# EAGLE design PitchshiftDelay-dsPIC_v2.3 (EAGLE 9.1.3)

## Sheet 1 of 4
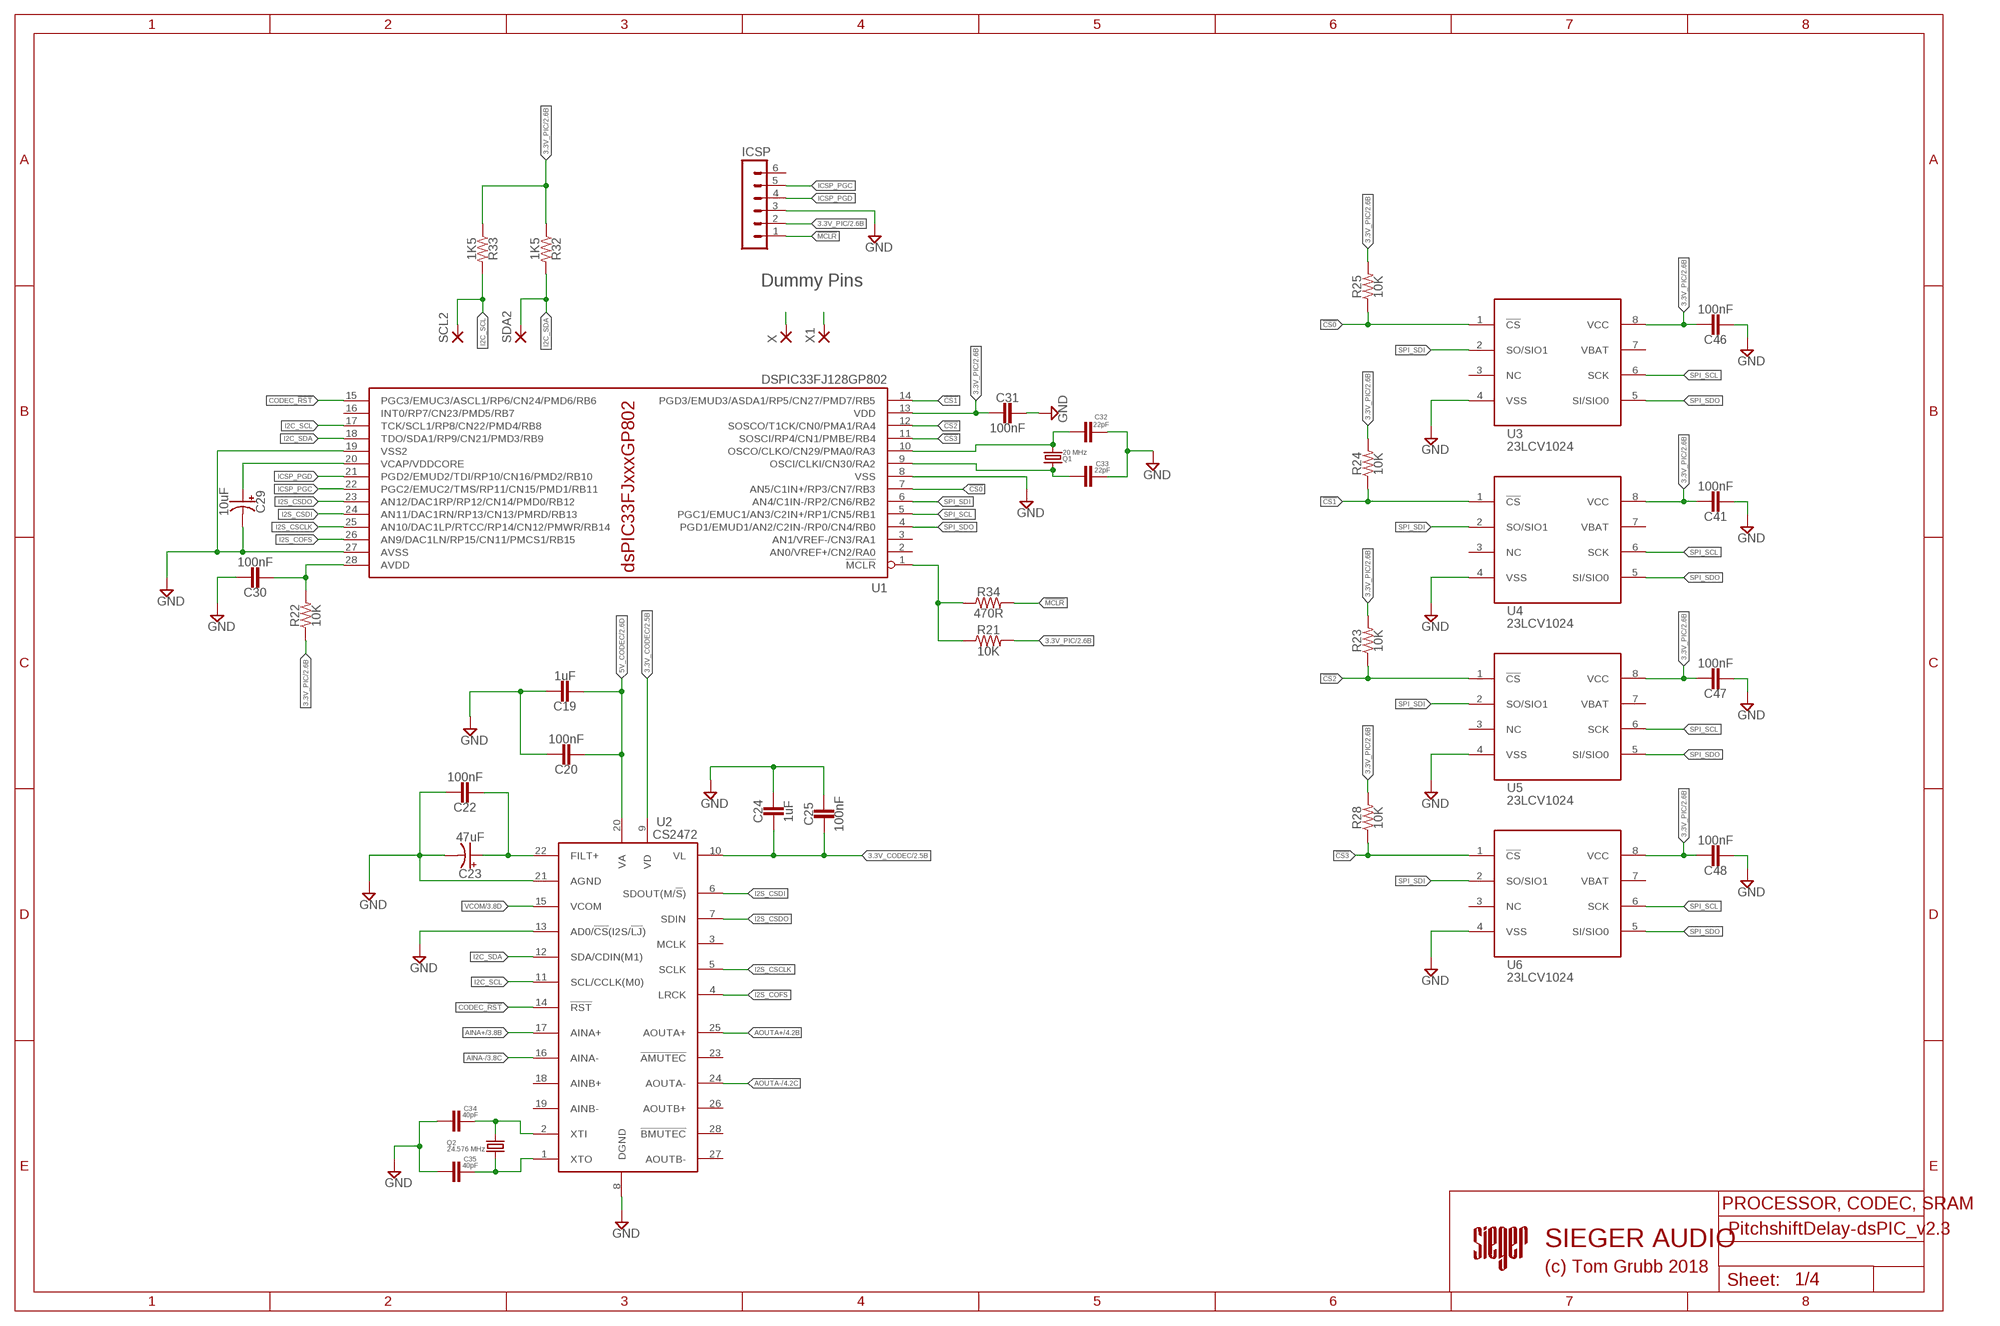
[diagram p0: schematic, sheet 1]

### Parts
C19  1uF  CER/FILM1  [050X030_025]
C20  100nF  CER/FILM1  [050X030_025]
C22  100nF  CER/FILM1  [050X030_025]
C23  47uF  0501  [050_020_1]
C24  1uF  CER/FILM1  [050X030_025]
C25  100nF  CER/FILM1  [050X030_025]
C29  10uF  0501B  [050_020_1B]
C30  100nF  CER/FILM1  [050X030_025]
C31  100nF  CER/FILM1  [050X030_025]
C32  22pF  CER/FILM  [0805]
C33  22pF  CER/FILM  [0805]
C34  40pF  CER/FILM  [0805]
C35  40pF  CER/FILM  [0805]
C41  100nF  CER/FILM1  [050X030_025]
C46  100nF  CER/FILM1  [050X030_025]
C47  100nF  CER/FILM1  [050X030_025]
C48  100nF  CER/FILM1  [050X030_025]
ICSP  MA06-1  [MA06-1]
Q1  20 MHz  CRYSTALHC49U-V  [HC49U-V]
Q2  24.576 MHz  CRYSTALHC49U-V  [HC49U-V]
R21  10K  RESISTOR0805  [RESISTOR_C0805]
R22  10K  RESISTOR0805  [RESISTOR_C0805]
R23  10K  RESISTOR0805  [RESISTOR_C0805]
R24  10K  RESISTOR0805  [RESISTOR_C0805]
R25  10K  RESISTOR0805  [RESISTOR_C0805]
R28  10K  RESISTOR0805  [RESISTOR_C0805]
R32  1K5  RESISTOR0805  [RESISTOR_C0805]
R33  1K5  RESISTOR0805  [RESISTOR_C0805]
R34  470R  RESISTOR0805  [RESISTOR_C0805]
SCL2  2,15/1,0  [2,15/1,0]
SDA2  2,15/1,0  [2,15/1,0]
U1  DSPIC33FJ128GP802  DSPIC33FJXXXGP802SMT  [SO28W]
U2  CS2472  [TSSOP28L]
U3  23LCV1024  [SOIC8]
U4  23LCV1024  [SOIC8]
U5  23LCV1024  [SOIC8]
U6  23LCV1024  [SOIC8]
X  2,15/1,0  [2,15/1,0]
X1  2,15/1,0  [2,15/1,0]

### Nets
3.3V_CODEC: C24.2 C25.2 U2.9(VD) U2.10(VL) ; also sheet 2
3.3V_PIC: C31.2 C41.1 C46.1 C47.1 C48.1 ICSP.2 R21.2 R22.1 R23.2 R24.2 R25.2 R28.2 R32.1 R33.1 U1.13(VDD) U3.8(VCC) U4.8(VCC) U5.8(VCC) U6.8(VCC) ; also sheet 2,4
5V_CODEC: C19.2 C20.2 U2.20(VA) ; also sheet 2
!CS0: R25.1 U1.7(AN5/C1IN+/RP3/CN7/RB3) U3.1(!CS)
!CS1: R24.1 U1.14(PGD3/EMUD3/ASDA1/RP5/CN27/PMD7/RB5) U4.1(!CS)
!CS2: R23.1 U1.12(SOSCO/T1CK/CN0/PMA1/RA4) U5.1(!CS)
!CS3: R28.1 U1.11(SOSCI/RP4/CN1/PMBE/RB4) U6.1(!CS)
!MCLR: ICSP.1 R34.2
AINA+: U2.17(AINA+) ; also sheet 3
AINA-: U2.16(AINA-) ; also sheet 3
AOUTA+: U2.25(AOUTA+) ; also sheet 4
AOUTA-: U2.24(AOUTA-) ; also sheet 4
CODEC_!RST: U1.15(PGC3/EMUC3/ASCL1/RP6/CN24/PMD6/RB6) U2.14(!RST)
FILT+: C22.2 C23.+ U2.22(FILT+)
GND: C19.1 C20.1 C22.1 C23.- C24.1 C25.1 C29.- C30.1 C31.1 C32.1 C33.1 C34.2 C35.2 C41.2 C46.2 C47.2 C48.2 ICSP.3 U1.8(VSS) U1.19(VSS2) U1.27(AVSS) U2.8(DGND) U2.13(AD0/!CS!(I2S/!LJ!)) U2.21(AGND) U3.4(VSS) U4.4(VSS) U5.4(VSS) U6.4(VSS) ; also sheet 2,3,4
I2C_SCL: R33.2 SCL2.1(P) U1.17(TCK/SCL1/RP8/CN22/PMD4/RB8) U2.11(SCL/CCLK(M0)) X.1(P)
I2C_SDA: R32.2 SDA2.1(P) U1.18(TDO/SDA1/RP9/CN21/PMD3/RB9) U2.12(SDA/CDIN(M1))
I2S_COFS: U1.26(AN9/DAC1LN/RP15/CN11/PMCS1/RB15) U2.4(LRCK)
I2S_CSCLK: U1.25(AN10/DAC1LP/RTCC/RP14/CN12/PMWR/RB14) U2.5(SCLK)
I2S_CSDI: U1.24(AN11/DAC1RN/RP13/CN13/PMRD/RB13) U2.6(SDOUT(M/!S!))
I2S_CSDO: U1.23(AN12/DAC1RP/RP12/CN14/PMD0/RB12) U2.7(SDIN)
ICSP_PGC: ICSP.5 U1.22(PGC2/EMUC2/TMS/RP11/CN15/PMD1/RB11)
ICSP_PGD: ICSP.4 U1.21(PGD2/EMUD2/TDI/RP10/CN16/PMD2/RB10)
N$8: C30.2 R22.2 U1.28(AVDD)
N$24: X1.1(P)
N$33: C29.+ U1.20(VCAP/VDDCORE)
N$34: C33.2 Q1.1 U1.9(OSCI/CLKI/CN30/RA2)
N$35: C32.2 Q1.2 U1.10(OSCO/CLKO/CN29/PMA0/RA3)
N$43: R21.1 R34.1 U1.1(!MCLR)
N$45: C34.1 Q2.2 U2.2(XTI)
N$48: C35.1 Q2.1 U2.1(XTO)
SPI_SCL: U1.5(PGC1/EMUC1/AN3/C2IN+/RP1/CN5/RB1) U3.6(SCK) U4.6(SCK) U5.6(SCK) U6.6(SCK)
SPI_SDI: U1.6(AN4/C1IN-/RP2/CN6/RB2) U3.2(SO/SIO1) U4.2(SO/SIO1) U5.2(SO/SIO1) U6.2(SO/SIO1)
SPI_SDO: U1.4(PGD1/EMUD1/AN2/C2IN-/RP0/CN4/RB0) U3.5(SI/SIO0) U4.5(SI/SIO0) U5.5(SI/SIO0) U6.5(SI/SIO0)
VCOM: U2.15(VCOM) ; also sheet 3
Unconnected: ICSP.6 U1.2(AN0/VREF+/CN2/RA0) U1.3(AN1/VREF-/CN3/RA1) U1.16(INT0/RP7/CN23/PMD5/RB7) U2.3(MCLK) U2.18(AINB+) U2.19(AINB-) U2.23(!AMUTEC) U2.26(AOUTB+) U2.27(AOUTB-) U2.28(!BMUTEC) U3.3(NC) U3.7(VBAT) U4.3(NC) U4.7(VBAT) U5.3(NC) U5.7(VBAT) U6.3(NC) U6.7(VBAT)

### Notes on the sheet
- Dummy Pins
- PROCESSOR, CODEC, SRAM
- SIEGER AUDIO
- (c) Tom Grubb 2018

## Sheet 2 of 4
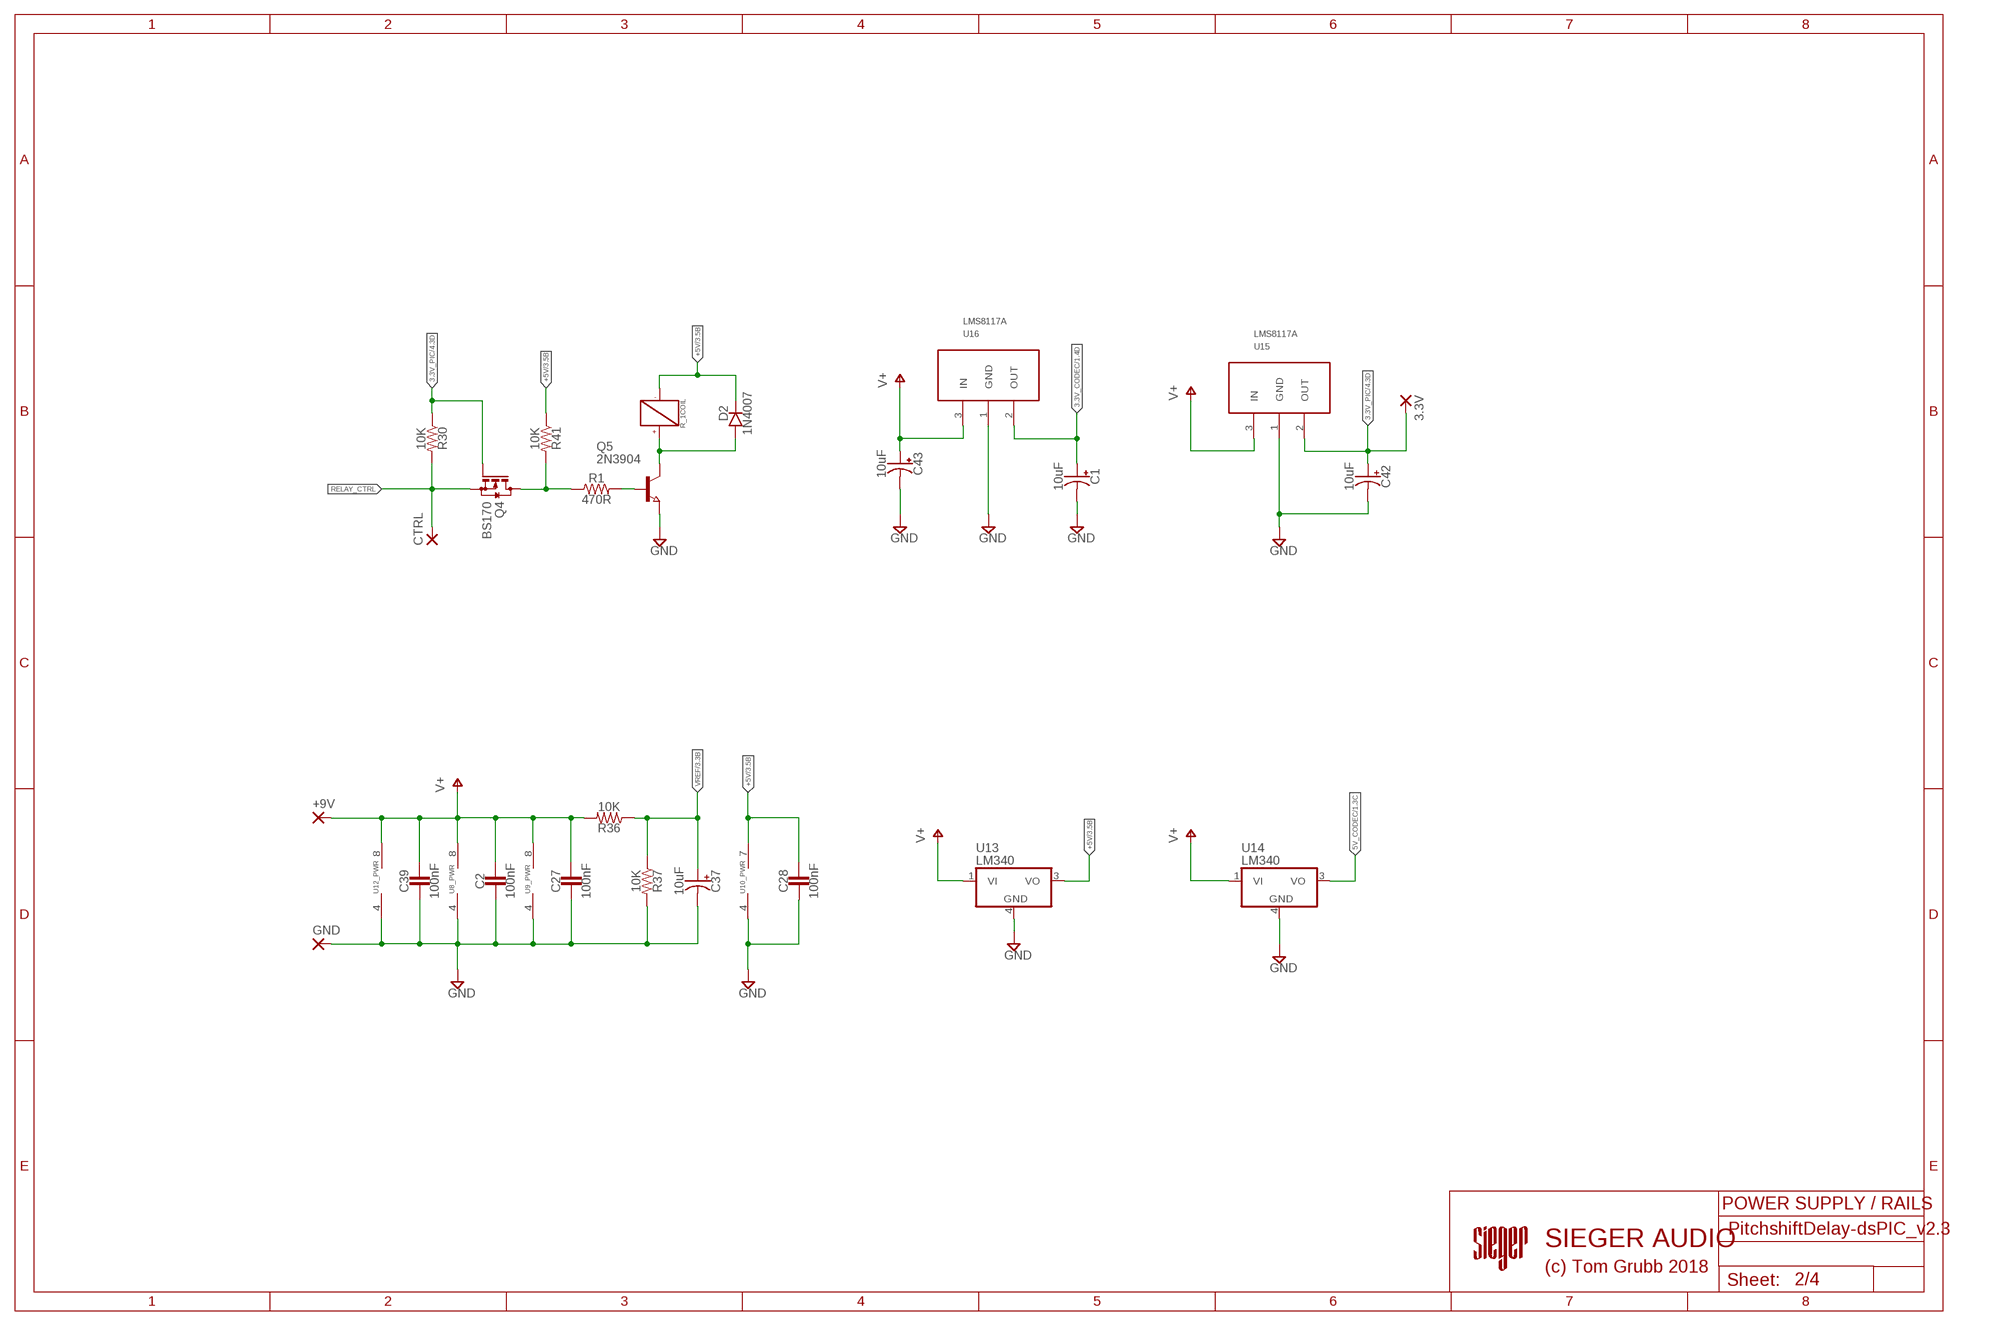
[diagram p1: schematic, sheet 2]

### Parts
3.3V  2,15/1,0  [2,15/1,0]
+9V  2,15/1,0  [2,15/1,0]
C1  10uF  0501  [050_020_1]
C2  100nF  CER/FILM1  [050X030_025]
C27  100nF  CER/FILM1  [050X030_025]
C28  100nF  CER/FILM1  [050X030_025]
C37  10uF  0501  [050_020_1]
C39  100nF  CER/FILM1  [050X030_025]
C42  10uF  0501  [050_020_1]
C43  10uF  0501  [050_020_1]
CTRL  2,15/1,0  [2,15/1,0]
D2  1N4007  DO35.3  [DO35-3]
GND  2,15/1,0  [2,15/1,0]
Q4  BS170  BSS123  [SOT23]
Q5  2N3904  NPN-TRANSISTOR_SOT23  [SOT23]
R1  470R  RESISTOR0805  [RESISTOR_C0805]
R30  10K  RESISTOR0805  [RESISTOR_C0805]
R36  10K  RESISTOR0805  [RESISTOR_C0805]
R37  10K  RESISTOR0805  [RESISTOR_C0805]
R41  10K  RESISTOR0805  [RESISTOR_C0805]
R_1  AL5WNK_2  [10PIN]
U8  LF353  DUALSMD  [SO08]
U9  LF353  DUALSMD  [SO08]
U10  OP1177  [MSOP8]
U12  LF353  DUALSMD  [SO08]
U13  LM340  LM340MP-05  [SOT223]
U14  LM340  LM340MP-05  [SOT223]
U15  LMS8117A  [SOT223]
U16  LMS8117A  [SOT223]

### Nets
3.3V_CODEC: C1.+ U16.2(OUT) ; also sheet 1
3.3V_PIC: 3.3V.1(P) C42.+ Q4.1(G) R30.1 U15.2(OUT) ; also sheet 1,4
5V_CODEC: U14.3(VO) ; also sheet 1
+5V: C28.1 D2.C R41.1 R_1.P$10(COIL:-) U10.7(_PWR:V+) U13.3(VO) ; also sheet 3
GND: C1.- C2.2 C27.2 C28.2 C37.- C39.2 C42.- C43.- GND.1(P) Q5.2(E) R37.2 U8.4(_PWR:V-) U9.4(_PWR:V-) U10.4(_PWR:V-) U12.4(_PWR:V-) U13.4(GND) U14.4(GND) U15.1(GND) U16.1(GND) ; also sheet 1,3,4
N$6: Q5.1(B) R1.2
N$22: D2.A Q5.3(C) R_1.P$1(COIL:+)
N$54: Q4.3(D) R1.1 R41.2
RELAY_CTRL: CTRL.1(P) Q4.2(S) R30.2
V+: +9V.1(P) C2.1 C27.1 C39.1 C43.+ R36.2 U8.8(_PWR:V+) U9.8(_PWR:V+) U12.8(_PWR:V+) U13.1(VI) U14.1(VI) U15.3(IN) U16.3(IN)
VREF: C37.+ R36.1 R37.1 ; also sheet 3,4

### Notes on the sheet
- POWER SUPPLY / RAILS
- SIEGER AUDIO
- (c) Tom Grubb 2018

## Sheet 3 of 4
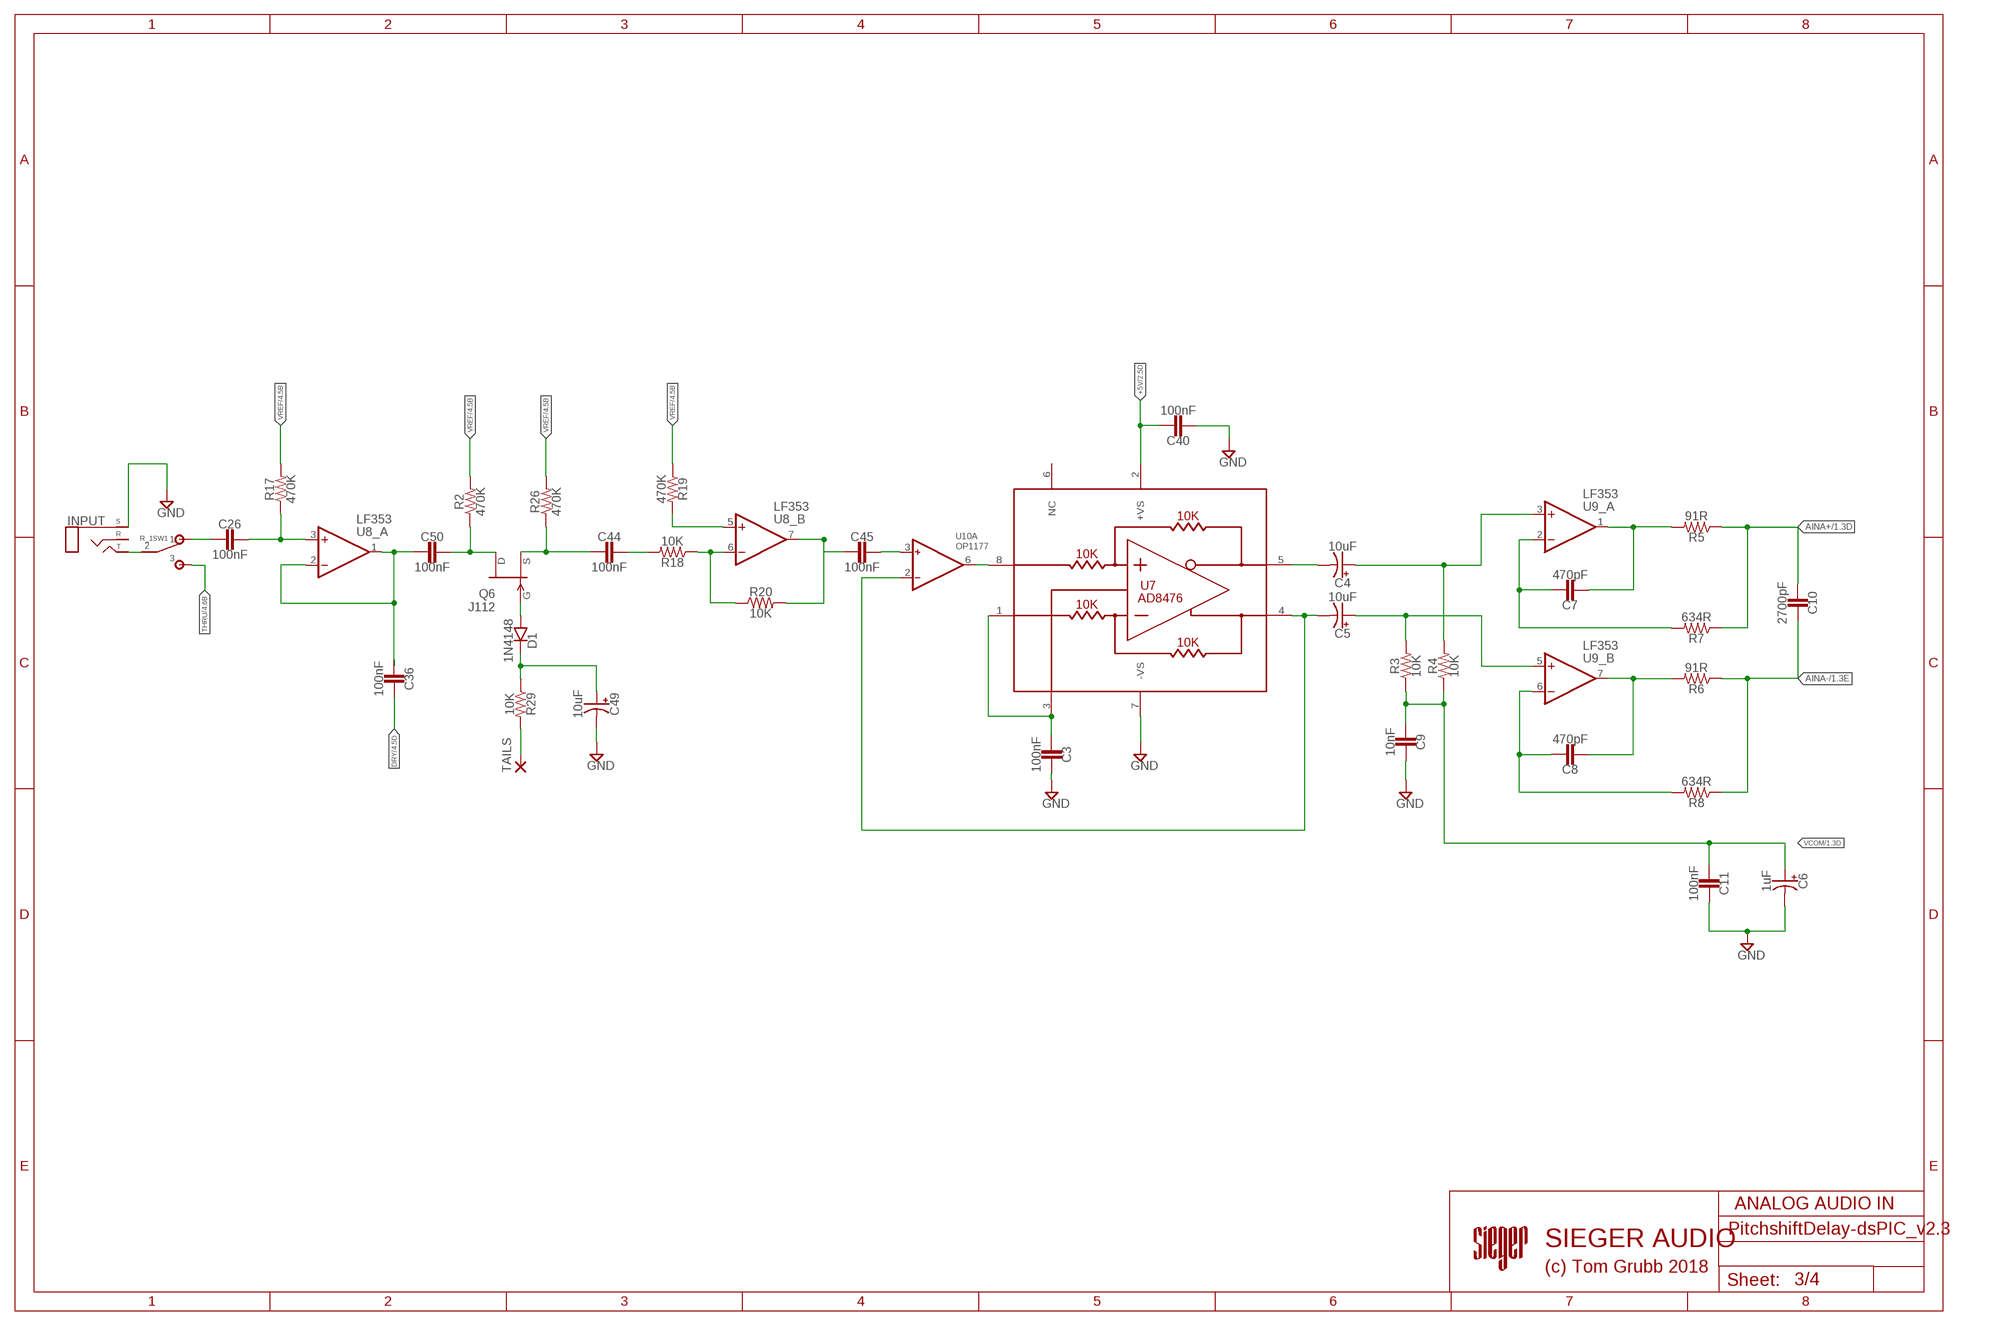
[diagram p2: schematic, sheet 3]

### Parts
C3  100nF  CER/FILM1  [050X030_025]
C4  10uF  0501  [050_020_1]
C5  10uF  0501  [050_020_1]
C6  1uF  0501  [050_020_1]
C7  470pF  CER/FILMBOX.1  [BOX_SMALL]
C8  470pF  CER/FILMBOX.1  [BOX_SMALL]
C9  10nF  CER/FILM1  [050X030_025]
C10  2700pF  CER/FILMBOX.1  [BOX_SMALL]
C11  100nF  CER/FILM1  [050X030_025]
C26  100nF  CER/FILMBOX.1  [BOX_SMALL]
C36  100nF  CER/FILMBOX.1  [BOX_SMALL]
C40  100nF  CER/FILM1  [050X030_025]
C44  100nF  CER/FILMBOX.1  [BOX_SMALL]
C45  100nF  CER/FILMBOX.1  [BOX_SMALL]
C49  10uF  0501  [050_020_1]
C50  100nF  CER/FILMBOX.1  [BOX_SMALL]
D1  1N4148  DO35.3  [DO35-3]
INPUT  STEREO  [STEREO_PCB]
Q6  J112  SST201  [SOT23]
R2  470K  RESISTOR0805  [RESISTOR_C0805]
R3  10K  RESISTOR0805  [RESISTOR_C0805]
R4  10K  RESISTOR0805  [RESISTOR_C0805]
R5  91R  RESISTOR0805  [RESISTOR_C0805]
R6  91R  RESISTOR0805  [RESISTOR_C0805]
R7  634R  RESISTOR0805  [RESISTOR_C0805]
R8  634R  RESISTOR0805  [RESISTOR_C0805]
R17  470K  RESISTOR0805  [RESISTOR_C0805]
R18  10K  RESISTOR0805  [RESISTOR_C0805]
R19  470K  RESISTOR0805  [RESISTOR_C0805]
R20  10K  RESISTOR0805  [RESISTOR_C0805]
R26  470K  RESISTOR0805  [RESISTOR_C0805]
R29  10K  RESISTOR0805  [RESISTOR_C0805]
TAILS  2,15/1,0  [2,15/1,0]
U7  AD8476  [MSOP8]

### Nets
+5V: C40.1 U7.2(+VS) ; also sheet 2
AINA+: C10.2 R5.1 R7.1 ; also sheet 1
AINA-: C10.1 R6.1 R8.1 ; also sheet 1
DRY: C36.1 ; also sheet 4
GND: C3.1 C6.- C9.1 C11.1 C40.2 C49.- INPUT.P$1(S) U7.7(-VS) ; also sheet 1,2,4
N$1: C45.1 U10.3(A:+IN)
N$3: C3.2 U7.1(IN-) U7.3(VCOM)
N$4: U7.8(IN+) U10.6(A:OUT)
N$5: C5.- U7.4(+OUT) U10.2(A:-IN)
N$7: C36.2 C50.2 U8.1(_A:OUT) U8.2(_A:-IN)
N$10: C26.1 R17.1 U8.3(_A:+IN)
N$11: C4.- U7.5(-OUT)
N$12: C5.+ R3.2 U9.5(_B:+IN)
N$13: C4.+ R4.2 U9.3(_A:+IN)
N$15: C8.1 R8.2 U9.6(_B:-IN)
N$16: C8.2 R6.2 U9.7(_B:OUT)
N$17: C7.1 R7.2 U9.2(_A:-IN)
N$18: C7.2 R5.2 U9.1(_A:OUT)
N$28: C26.2 R_1.P$2
N$29: R18.1 R20.1 U8.6(_B:-IN)
N$30: R19.2 U8.5(_B:+IN)
N$31: C50.1 Q6.1(D) R2.1
N$32: C45.2 R20.2 U8.7(_B:OUT)
N$37: C44.1 R18.2
N$39: INPUT.P$3(T) R_1.P$3
N$40: C44.2 Q6.2(S) R26.1
N$41: C49.+ D1.C R29.1
N$46: D1.A Q6.3(G)
N$51: R29.2 TAILS.1(P)
THRU: R_1.P$4 ; also sheet 4
VCOM: C6.+ C9.2 C11.2 R3.1 R4.1 ; also sheet 1
VREF: R2.2 R17.2 R19.1 R26.2 ; also sheet 2,4
Unconnected: INPUT.P$2(R) U7.6(NC)

### Notes on the sheet
- ANALOG AUDIO IN
- SIEGER AUDIO
- (c) Tom Grubb 2018

## Sheet 4 of 4
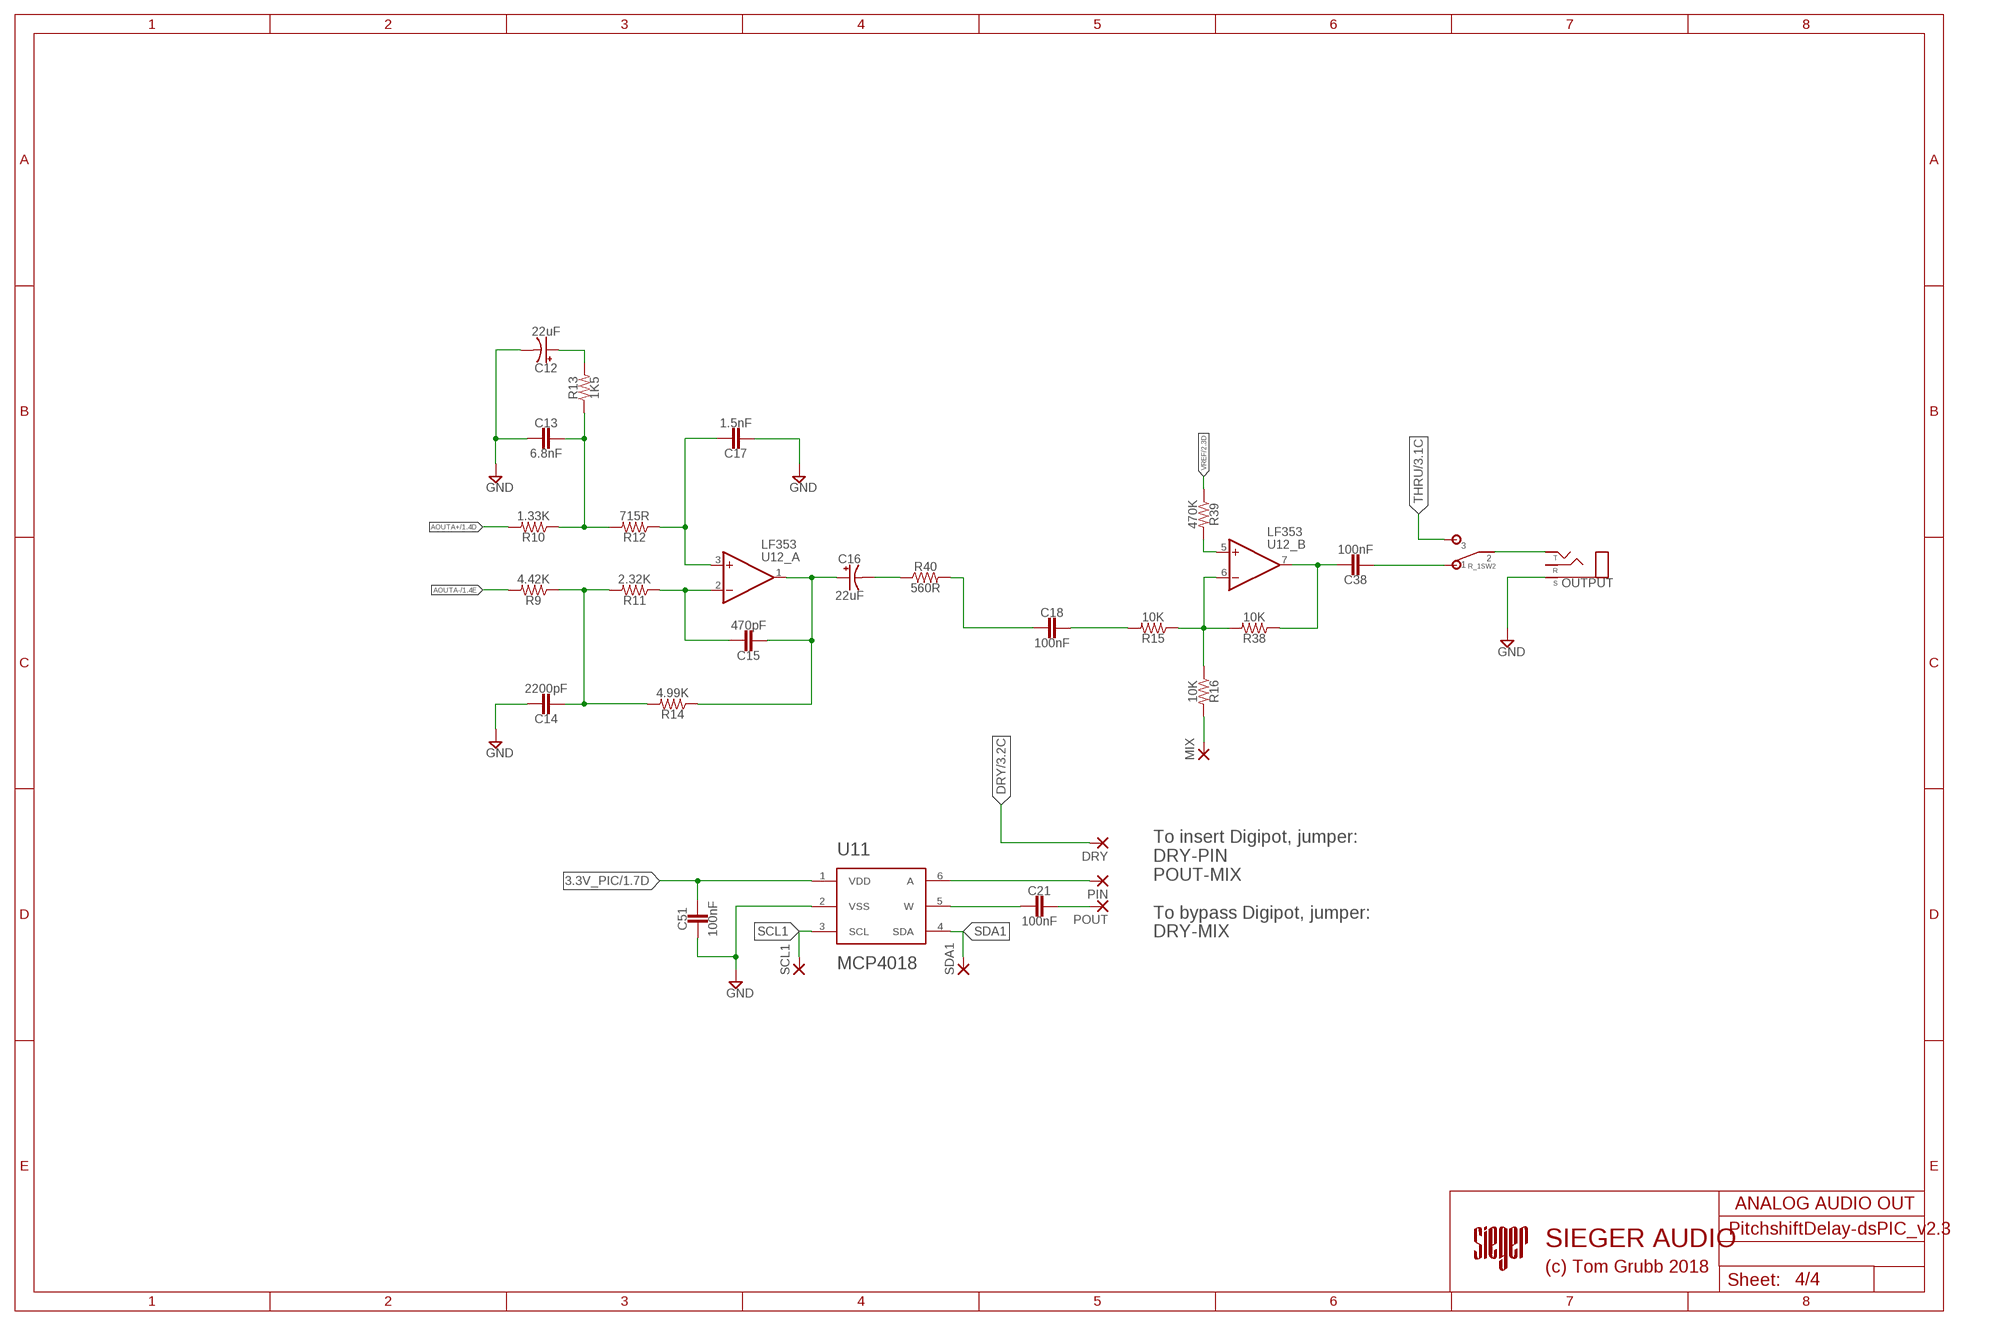
[diagram p3: schematic, sheet 4]

### Parts
C12  22uF  0501  [050_020_1]
C13  6.8nF  CER/FILMBOX.1  [BOX_SMALL]
C14  2200pF  CER/FILMBOX.1  [BOX_SMALL]
C15  470pF  CER/FILMBOX.1  [BOX_SMALL]
C16  22uF  0501  [050_020_1]
C17  1.5nF  CER/FILMBOX.1  [BOX_SMALL]
C18  100nF  CER/FILMBOX.1  [BOX_SMALL]
C21  100nF  CER/FILMBOX.1  [BOX_SMALL]
C38  100nF  CER/FILMBOX.1  [BOX_SMALL]
C51  100nF  CER/FILM1  [050X030_025]
DRY  2,15/1,0  [2,15/1,0]
MIX  2,15/1,0  [2,15/1,0]
OUTPUT  STEREO  [STEREO_PCB]
PIN  2,15/1,0  [2,15/1,0]
POUT  2,15/1,0  [2,15/1,0]
R9  4.42K  RESISTOR0805  [RESISTOR_C0805]
R10  1.33K  RESISTOR0805  [RESISTOR_C0805]
R11  2.32K  RESISTOR0805  [RESISTOR_C0805]
R12  715R  RESISTOR0805  [RESISTOR_C0805]
R13  1K5  RESISTOR0805  [RESISTOR_C0805]
R14  4.99K  RESISTOR0805  [RESISTOR_C0805]
R15  10K  RESISTOR0805  [RESISTOR_C0805]
R16  10K  RESISTOR0805  [RESISTOR_C0805]
R38  10K  RESISTOR0805  [RESISTOR_C0805]
R39  470K  RESISTOR0805  [RESISTOR_C0805]
R40  560R  RESISTOR0805  [RESISTOR_C0805]
SCL1  2,15/1,0  [2,15/1,0]
SDA1  2,15/1,0  [2,15/1,0]
U11  MCP4018  MCP401X  [SC70-6]

### Nets
3.3V_PIC: C51.1 U11.1(VDD) ; also sheet 1,2
AMUTE: C18.2 R40.2
AOUTA+: R10.2 ; also sheet 1
AOUTA-: R9.2 ; also sheet 1
DRY: DRY.1(P) ; also sheet 3
GND: C12.- C13.2 C14.1 C17.2 C51.2 OUTPUT.P$1(S) U11.2(VSS) ; also sheet 1,2,3
N$2: C21.2 U11.5(W)
N$9: C16.- R40.1
N$14: C13.1 R10.1 R12.2 R13.1
N$19: C14.2 R9.1 R11.2 R14.2
N$20: C15.1 R11.1 U12.2(_A:-IN)
N$21: C17.1 R12.1 U12.3(_A:+IN)
N$23: C15.2 C16.+ R14.1 U12.1(_A:OUT)
N$25: MIX.1(P) R16.2
N$26: C18.1 R15.2
N$27: C12.+ R13.2
N$36: OUTPUT.P$3(T) R_1.P$8
N$38: C38.2 R_1.P$9
N$42: PIN.1(P) U11.6(A)
N$44: R15.1 R16.1 R38.2 U12.6(_B:-IN)
N$47: C38.1 R38.1 U12.7(_B:OUT)
N$49: R39.2 U12.5(_B:+IN)
N$50: C21.1 POUT.1(P)
SCL1: SCL1.1(P) U11.3(SCL)
SDA1: SDA1.1(P) U11.4(SDA)
THRU: R_1.P$7 ; also sheet 3
VREF: R39.1 ; also sheet 2,3
Unconnected: OUTPUT.P$2(R)

### Notes on the sheet
- To insert Digipot, jumper:
  DRY-PIN
  POUT-MIX
  
  To bypass Digipot, jumper:
  DRY-MIX
- ANALOG AUDIO OUT
- SIEGER AUDIO
- (c) Tom Grubb 2018

## Library data of the parts
3.3V +9V CTRL DRY GND MIX PIN POUT SCL1 SCL2 SDA1 SDA2 TAILS X X1 = wirepad:2,15/1,0: THROUGH-HOLE PAD
C1 C4-C6 C12 C16 C23 C29 C37 C42 C43 C49 = MBP_capacitors-elec:050: 0.22 - 100uF Xicon values at Mouser.com: 10V: 10 - 100uF; 16V: 2.2 - 47uF; 25V: 0.47 - 47uF; 50V: 0.22 - 22uF
C2 C3 C7-C11 C13-C15 C17-C22 C24-C28 C30-C36 C38-C41 C44-C48 C50 C51 = MBP_capacitors-film:CER/FILM: 47 - 120pF Xicon Ceramic Disc 2.5mm lead spacing
D1 D2 = MBP_diodes:DO35: DO-35 Package Diodes: 1N914
ICSP = con-lstb:MA06-1: PIN HEADER; OC_FARNELL: unknown; OC_NEWARK: unknown
INPUT OUTPUT = MBP_jacks:STEREO
Q1 Q2 = crystal:CRYSTAL: CRYSTAL; OC_FARNELL: 1666969; OC_NEWARK: unknown
Q4 = transistor-small-signal:BSS123: N-CHANNEL MOS FET
Q5 = semicon-smd-ipc:NPN-TRANSISTOR_: NPN TRANSISTOR
Q6 = transistor-fet:?20*: TEMIC / Siliconix N-Channel JFET Source: JFET-J201_Siliconix_data.pdf
R1-R26 R28-R30 R32-R34 R36-R41 = MBP_SMD:RESISTOR
R_1 = MBP_Relay:AL5WNK_2
U1 = microchip-dspic33:DSPIC33FJXXXGP802: High-Performance, 16-bit Digital Signal Controllers - dsPIC33FJ64GP802 & dsPIC33FJ128GP802 Source: http://ww1.microchip.com/downloads/en/DeviceDoc/70292B.pdf Operating Range: . Up to 40 MIPS operation (at 3.0-3.6V): - Industrial temperature range (-40°C to +85°C) - Extended temperature range (-40°C to +125°C) High-Performance DSC CPU: . Modified Harvard architecture . C compiler optimized instruction set . 16-bit wide data path . 24-bit wide instructions . Linear program memory addressing up to 4M instruction words . Linear data memory addressing up to 64 Kbytes . 83 base instructions: mostly 1 word/1 cycle . Two 40-bit accumulators with rounding and saturation options . Flexible and powerful addressing modes: - Indirect - Modulo - Bit-Reversed . Software stack . 16 x 16 fractional/integer multiply operations . 32/16 and 16/16 divide operations . Single-cycle multiply and accumulate: - Accumulator write back for DSP operations - Dual data fetch . Up to ±16-bit shifts for up to 40-bit data On-Chip Flash and SRAM: . Flash program memory . Data SRAM . Boot, Secure, and General Security for program Flash Direct Memory Access (DMA): . 8-channel hardware DMA . Up to 2 Kbytes dual ported DMA buffer area (DMA RAM) to store data transferred via DMA: - Allows data transfer between RAM and a peripheral while CPU is executing code (no cycle stealing) . Most peripherals support DMA Timers/Capture/Compare/PWM: . Timer/Counters, up to five 16-bit timers: - Can pair up to make two 32-bit timers - One timer runs as a Real-Time Clock with an external 32.768 kHz oscillator - Programmable prescaler . Input Capture (up to four channels): - Capture on up, down or both edges - 16-bit capture input functions - 4-deep FIFO on each capture . Output Compare (up to four channels): - Single or Dual 16-bit Compare mode - 16-bit Glitchless PWM mode . Hardware Real-Time Clock/Calendar (RTCC): - Provides clock, calendar, and alarm functions Interrupt Controller: . 5-cycle latency . 118 interrupt vectors . Up to 49 available interrupt sources . Up to three external interrupts . Seven programmable priority levels . Five processor exceptions Digital I/O: . Peripheral pin Select functionality . Up to 35 programmable digital I/O pins . Wake-up/Interrupt-on-Change for up to 21 pins . Output pins can drive from 3.0V to 3.6V . Up to 5V output with open drain configuration . All digital input pins are 5V tolerant . 4 mA sink on all I/O pins System Management: . Flexible clock options: - External, crystal, resonator, internal RC - Fully integrated Phase-Locked Loop (PLL) - Extremely low jitter PLL . Power-up Timer . Oscillator Start-up Timer/Stabilizer . Watchdog Timer with its own RC oscillator . Fail-Safe Clock Monitor . Reset by multiple sources Power Management: . On-chip 2.5V voltage regulator . Switch between clock sources in real time . Idle, Sleep, and Doze modes with fast wake-up Analog-to-Digital Converters (ADCs): . 10-bit, 1.1 Msps or 12-bit, 500 Ksps conversion: - Two and four simultaneous samples (10-bit ADC) - Up to 13 input channels with auto-scanning - Conversion start can be manual or synchronized with one of four trigger sources - Conversion possible in Sleep mode - ±2 LSb max integral nonlinearity - ±1 LSb max differential nonlinearity Audio Digital-to-Analog Converter (DAC): . 16-bit Dual Channel DAC module . 100 Ksps maximum sampling rate . Second-Order Digital Delta-Sigma Modulator Data Converter Interface (DCI) module: . Codec interface . Supports I2S and AC.97 protocols . Up to 16-bit data words, up to 16 words per frame . 4-word deep TX and RX buffers Comparator Module: . Two analog comparators with programmable input/output configuration CMOS Flash Technology: . Low-power, high-speed Flash technology . Fully static design . 3.3V (±10%) operating voltage . Industrial and Extended temperature . Low power consumption Communication Modules: . 4-wire SPI (up to two modules): - Framing supports I/O interface to simple codecs - Supports 8-bit and 16-bit data - Supports all serial clock formats and sampling modes . I2C?: - Full Multi-Master Slave mode support - 7-bit and 10-bit addressing - Bus collision detection and arbitration - Integrated signal conditioning - Slave address masking . UART (up to two modules): - Interrupt on address bit detect - Interrupt on UART error - Wake-up on Start bit from Sleep mode - 4-character TX and RX FIFO buffers - LIN bus support - IrDA® encoding and decoding in hardware - High-Speed Baud mode - Hardware Flow Control with CTS and RTS . Enhanced CAN (ECAN. module) 2.0B active: - Up to eight transmit and up to 32 receive buffers - 16 receive filters and three masks - Loopback, Listen Only and Listen All - Messages modes for diagnostics and bus monitoring - Wake-up on CAN message - Automatic processing of Remote Transmission Requests - FIFO mode using DMA - DeviceNet. addressing support . Parallel Master Slave Port (PMP/EPSP): - Supports 8-bit or 16-bit data - Supports 16 address lines . Programmable Cyclic Redundancy Check (CRC): - Programmable bit length for the CRC generator polynomial (up to 16-bit length) - 8-deep, 16-bit or 16-deep, 8-bit FIFO for data input
U2 = CS4272:CS2472
U3-U6 = MicrochipSRAM:23LCV1024
U7 = ad8476:AD8476
U8 U9 U12 = MBP_integrated circuits:DUAL: OP AMP
U10 = AD_MSOP:OP1177
U11 = MicrochipDigiPot:MCP401X
U13 U14 = linear:LM340?-*: Positive VOLTAGE REGULATOR Source: http://cache.national.com/ds/LM/LM340.pdf
U15 U16 = LDO_Regulators:LMS8117A

## Board
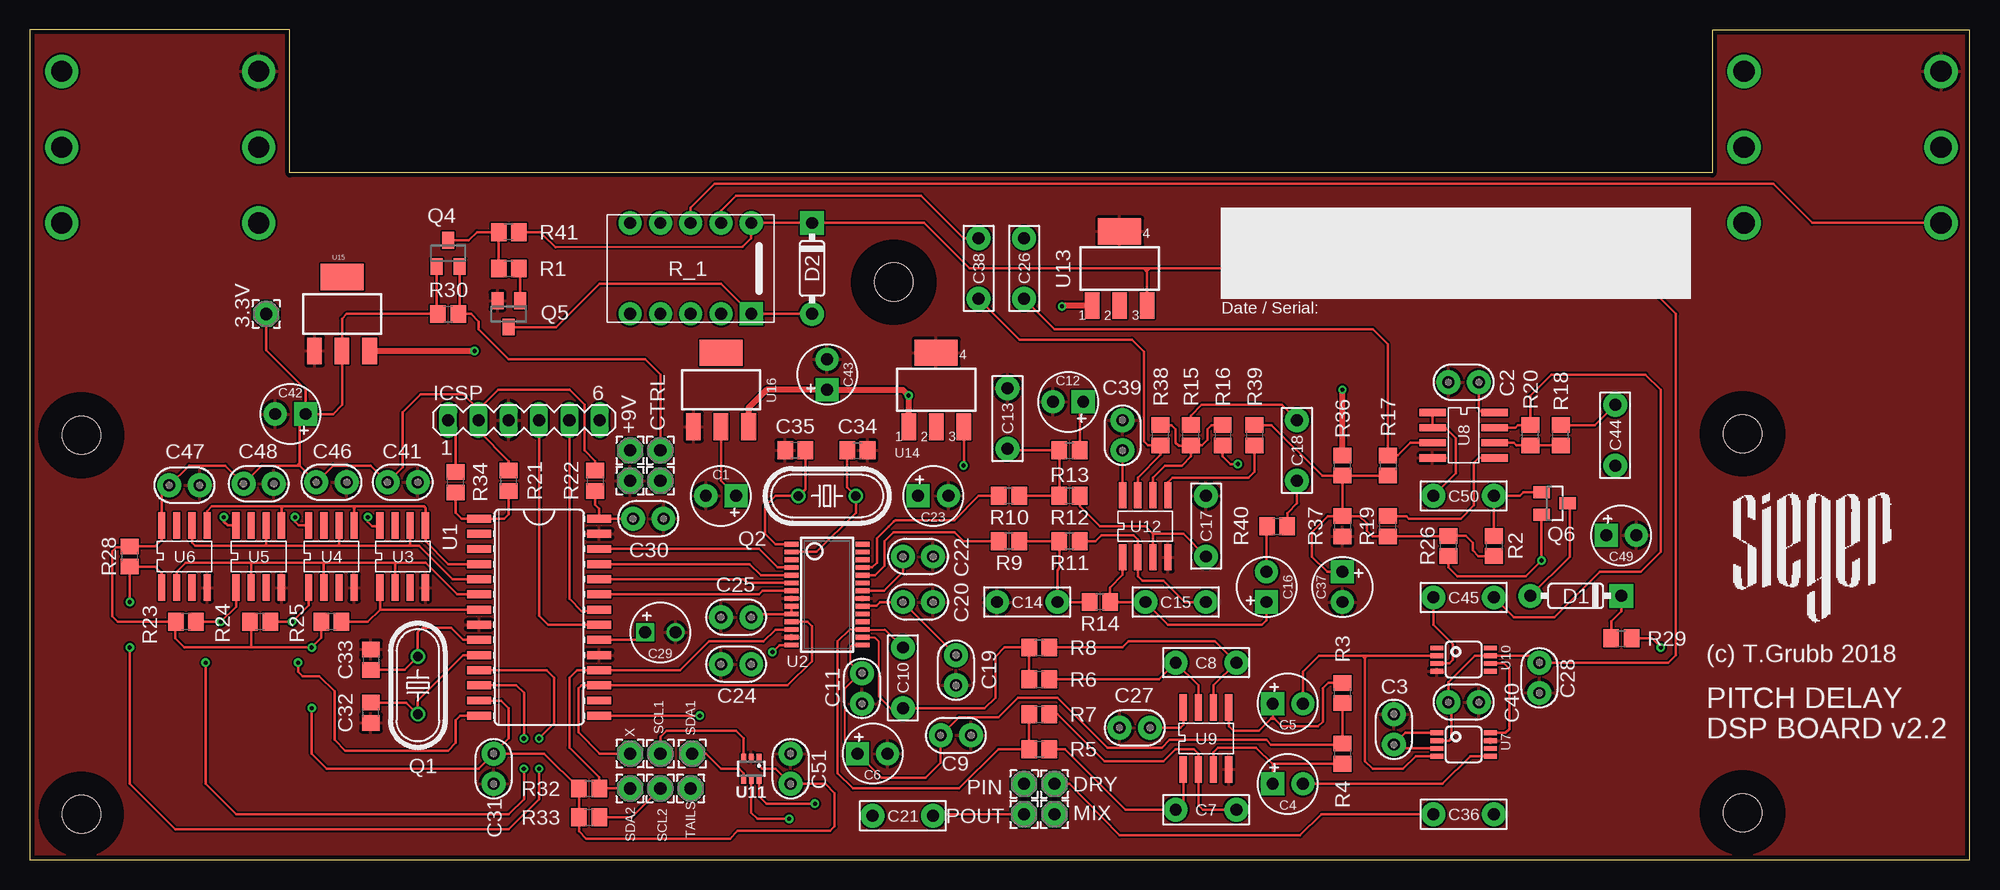
[diagram p4: board, top side]
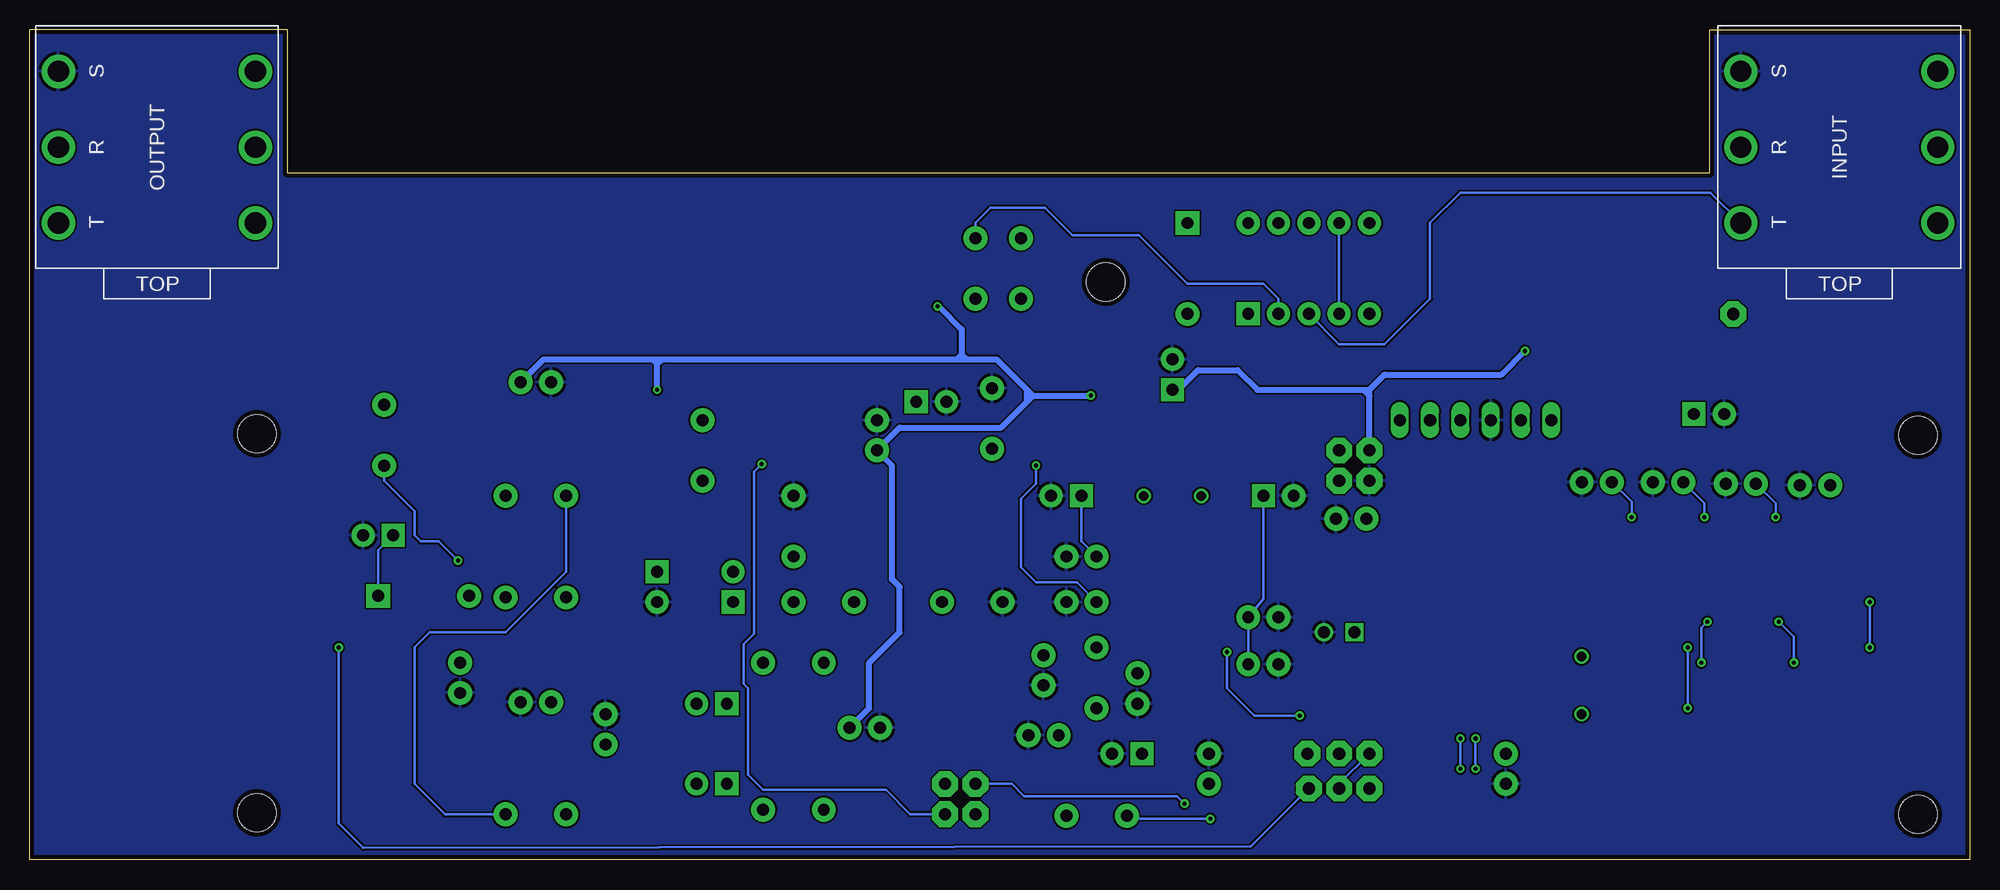
[diagram p5: board, bottom side, seen from below]

Size 162.54 x 69.52 mm. Coordinates in mm from the lower left corner, seen from the top.
Outline: 162.54,0 162.54,69.52 140.97,69.52 140.97,57.53 21.79,57.53 21.79,69.52 0,69.52 0,0 162.54,0
Copper layers (1*16): Top 0.0356mm / dielectric 1.5011mm / Bottom 0.0356mm
Design rules "LaenPCBOrder": minimum track width 6mil, minimum drill 13mil, track to track 6mil, track to pad 6mil, pad to pad 6mil, via to via 6mil, smd to smd 6mil, copper to edge 15mil, drill to drill 6mil, minimum pad ring 7mil, minimum via ring 7mil, stop-mask expansion 3mil, vias tented up to drill 0mil, thermal gap 10mil
Holes 3.2 mm at 4.32,35.56 4.32,3.81 143.51,3.94 143.51,35.69 72.39,48.39
tRestrict: area 0.8,32.1 to 7.8,39.1; area 0.8,0.3 to 7.8,7.3; area 68.9,44.9 to 75.9,51.9; area 140,32.2 to 147,39.2; area 140,0.4 to 147,7.4

### Footprints (pad centres in the part's own frame; a part is rotated, then mirrored left to right if it is on the bottom)
2,15/1,0 = drill 1.016 pad 2.159 octagon: 1 0,0
050_020_1 = drill 1 pad 1.93 square: + -1.27,0 | drill 1 pad 1.93: - 1.27,0
050X030_025 = drill 1 pad 2: 1 -1.27,0; 2 1.27,0
BOX_SMALL = drill 1 pad 2: 1 -2.54,0; 2 2.54,0
050_020_1B = drill 1 square: + -1.27,0 | drill 1: - 1.27,0
0805 = smd 1.3 x 1.5: 1 -0.85,0; 2 0.85,0
DO35-3 = drill 1 pad 2: A 3.81,0 | drill 1 pad 2 square: C -3.81,0
MA06-1 = drill 1.016 long: 1 -6.35,0; 2 -3.81,0; 3 -1.27,0; 4 1.27,0; 5 3.81,0; 6 6.35,0
STEREO_PCB = drill 1.778 pad 2.794: P$1 -6.35,-8.255; P$2 0,-8.255; P$3 6.35,-8.255; P$4 -6.35,8.255; P$5 0,8.255; P$6 6.35,8.255
HC49U-V = drill 0.813: 1 -2.413,0; 2 2.413,0
SOT23 = smd 1 x 1.4: 1 -0.95,-1.1; 2 0.95,-1.1; 3 0,1.1
RESISTOR_C0805 = smd 1.3 x 1.5: 1 -0.85,0; 2 0.85,0
10PIN = drill 1 pad 1.93 square: P$1 3.81,5.08 | drill 1 pad 1.93: P$2 3.81,2.54; P$3 3.81,0; P$4 3.81,-2.54; P$5 3.81,-5.08; P$6 -3.81,-5.08; P$7 -3.81,-2.54; P$8 -3.81,0; P$9 -3.81,2.54; P$10 -3.81,5.08
SO28W = smd 0.66 x 2.032: 1 -8.255,-5.029; 2 -6.985,-5.029; 3 -5.715,-5.029; 4 -4.445,-5.029; 5 -3.175,-5.029; 6 -1.905,-5.029; 7 -0.635,-5.029; 8 0.635,-5.029; 9 1.905,-5.029; 10 3.175,-5.029; 11 4.445,-5.029; 12 5.715,-5.029; 13 6.985,-5.029; 14 8.255,-5.029; 15 8.255,5.029; 16 6.985,5.029; 17 5.715,5.029; 18 4.445,5.029; 19 3.175,5.029; 20 1.905,5.029; 21 0.635,5.029; 22 -0.635,5.029; 23 -1.905,5.029; 24 -3.175,5.029; 25 -4.445,5.029; 26 -5.715,5.029; 27 -6.985,5.029; 28 -8.255,5.029
TSSOP28L = smd 0.4 x 1.2: 1 -3.575,-2.97; 2 -2.925,-2.97; 3 -2.275,-2.97; 4 -1.625,-2.97; 5 -0.975,-2.97; 6 -0.325,-2.97; 7 0.325,-2.97; 8 0.975,-2.97; 9 1.625,-2.97; 10 2.275,-2.97; 11 2.925,-2.97; 12 3.575,-2.97; 13 4.225,-2.97; 14 4.875,-2.97; 15 4.875,2.97; 16 4.225,2.97; 17 3.575,2.97; 18 2.925,2.97; 19 2.275,2.97; 20 1.625,2.97; 21 0.975,2.97; 22 0.325,2.97; 23 -0.325,2.97; 24 -0.975,2.97; 25 -1.625,2.97; 26 -2.275,2.97; 27 -2.925,2.97; 28 -3.575,2.97
SOIC8 = smd 0.6 x 2.2: 1 -1.905,-2.6; 2 -0.635,-2.6; 3 0.635,-2.6; 4 1.905,-2.6; 5 1.905,2.6; 6 0.635,2.6; 7 -0.635,2.6; 8 -1.905,2.6
MSOP8 = smd 0.4 x 1.1: 1 -0.975,-2.25; 2 -0.325,-2.25; 3 0.325,-2.25; 4 0.975,-2.25; 5 0.975,2.25; 6 0.325,2.25; 7 -0.325,2.25; 8 -0.975,2.25
SO08 = smd 0.6 x 2.2: 1 -1.905,-2.6; 2 -0.635,-2.6; 3 0.635,-2.6; 4 1.905,-2.6; 5 1.905,2.6; 6 0.635,2.6; 7 -0.635,2.6; 8 -1.905,2.6
SC70-6 = smd 0.4 x 0.6: 1 -0.65,-0.95; 2 0,-0.95; 3 0.65,-0.95; 4 0.65,0.95; 5 0,0.95; 6 -0.65,0.95
SOT223 = smd 1.219 x 2.235: 1 -2.311,-3.099; 2 0,-3.099; 3 2.311,-3.099 | smd 3.6 x 2.2: 4 0,3.099

### Placement (x,y rotation side)
3.3V  19.81,45.72 90 top
+9V  50.29,34.29 0 top
C1  57.91,30.48 180 top
C2  120.14,40 180 top
C3  114.3,10.92 270 top
C4  105.41,6.35 0 top
C5  105.41,13.08 0 top
C6  70.61,8.89 0 top
C7  98.55,4.19 180 top
C8  98.55,16.51 180 top
C9  77.6,10.41 180 top
C10  73.15,15.24 90 top
C11  69.72,14.35 90 top
C12  87,38.35 180 top
C13  81.92,36.96 90 top
C14  83.57,21.59 0 top
C15  96.01,21.59 180 top
C16  103.63,22.86 90 top
C17  98.55,27.94 90 top
C18  106.17,34.29 270 top
C19  77.6,15.87 90 top
C20  74.42,21.59 180 top
C21  73.15,3.68 180 top
C22  74.42,25.4 180 top
C23  75.69,30.48 0 top
C24  59.18,16.38 0 top
C25  59.18,20.32 0 top
C26  83.31,49.53 90 top
C27  92.58,11.05 180 top
C28  126.49,15.24 270 top
C29  52.83,19.05 0 top
C30  51.82,28.57 180 top
C31  38.86,7.62 90 top
C32  28.57,12.32 90 top
C33  28.57,16.76 270 top
C34  69.34,34.29 0 top
C35  64.13,34.29 180 top
C36  120.14,3.81 0 top
C37  109.98,22.86 270 top
C38  79.5,49.53 90 top
C39  91.57,35.56 90 top
C40  120.14,13.21 0 top
C41  31.24,31.62 0 top
C42  21.84,37.34 180 top
C43  66.8,40.64 90 top
C44  132.84,35.56 270 top
C45  120.14,21.97 0 top
C46  25.27,31.62 0 top
C47  12.95,31.37 0 top
C48  19.18,31.5 0 top
C49  133.35,27.18 0 top
C50  120.14,30.48 180 top
C51  63.75,7.62 90 top
CTRL  52.83,34.29 0 top
D1  129.54,22.1 180 top
D2  65.53,49.53 270 top
DRY  85.85,6.35 180 top
GND  50.29,31.75 270 top
ICSP  41.4,36.83 0 top
INPUT  10.92,59.69 270 bottom
MIX  85.85,3.81 270 top
OUTPUT  151.89,59.69 270 bottom
PIN  83.31,6.35 90 top
POUT  83.31,3.81 180 top
Q1  32.51,14.6 270 top
Q2  66.8,30.48 0 top
Q4  35.05,50.8 0 top
Q5  40.13,45.72 180 top
Q6  127.76,29.84 270 top
R1  40.13,49.53 0 top
R2  122.68,26.29 270 top
R3  109.98,13.97 90 top
R4  109.98,8.89 270 top
R5  84.58,9.27 0 top
R6  84.58,15.11 0 top
R7  84.58,12.19 0 top
R8  84.58,17.78 0 top
R9  82.04,26.67 180 top
R10  82.04,30.48 180 top
R11  87.12,26.67 180 top
R12  87.12,30.48 180 top
R13  87.12,34.29 0 top
R14  89.66,21.59 180 top
R15  97.28,35.56 90 top
R16  99.95,35.56 270 top
R17  113.79,33.02 270 top
R18  128.27,35.56 90 top
R19  113.79,27.94 90 top
R20  125.73,35.56 90 top
R21  40.13,31.75 90 top
R22  47.37,31.75 270 top
R23  13.08,19.94 180 top
R24  19.3,19.94 180 top
R25  25.27,19.94 180 top
R26  118.87,26.29 90 top
R28  8.38,25.4 90 top
R29  133.35,18.54 0 top
R30  35.05,45.72 0 top
R32  46.86,5.97 0 top
R33  46.86,3.56 0 top
R34  35.69,31.62 90 top
R36  109.98,33.02 90 top
R37  109.98,27.94 270 top
R38  94.74,35.56 90 top
R39  102.62,35.56 270 top
R40  104.52,27.94 0 top
R41  40.13,52.58 180 top
R_1  55.37,49.53 270 top
SCL1  52.83,8.89 180 top
SCL2  52.83,5.97 270 top
SDA1  55.5,8.89 180 top
SDA2  50.29,5.97 90 top
TAILS  55.37,5.97 270 top
U1  42.67,20.32 270 top
U2  66.8,22.86 270 top
U3  31.24,25.4 0 top
U4  25.27,25.4 0 top
U5  19.18,25.4 0 top
U6  12.95,25.4 0 top
U7  120.14,9.65 270 top
U8  120.14,35.56 270 top
U9  98.55,10.16 0 top
U10  120.14,16.76 270 top
U11  60.45,7.62 180 top
U12  93.47,27.94 0 top
U13  91.31,49.53 0 top
U14  75.95,39.37 0 top
U15  26.16,45.72 0 top
U16  57.91,39.37 0 top
U$1  [LARGE]  149.35,24.13 0 top
X  50.29,8.89 0 top
X1  52.83,31.75 270 top

### Tracks (layer width: path | path; a pad name or v marks a point on that pad's centre or on a via)
3.3V_CODEC
  Top 0.203: U2.9 U2.10 60.72,20.58 C25.2 | U16.2 57.91,31.75 C1.+
  Bottom 0.203: C1.+ 59.18,21.84 C25.2 C24.2
3.3V_PIC  (via drill 0.35)
  Top 0.203: 22.61,33.02 C46.1 25.4,33.02 28.57,33.02 C41.1 31.24,32.89 31.24,37.47 32.77,38.99 36.32,38.99 37.59,37.72 | 22.35,33.02 19.43,33.02 C48.1 16.38,33.02 13.34,33.02 C47.1 11.05,30.73 U6.8 11.05,26.8 10.5,26.25 R28.2 8.29,26.16 7.24,26.16 6.92,25.84 6.92,20.38 7.37,19.94 R23.2 12.19,19.9 12.19,18.54 12.95,17.78 18.41,17.78 | 22.35,33.02 22.61,33.02 | U3.8 29.28,27.94 28.7,27.94 28.32,28.32 v28.32,28.7 | v22.23,28.7 22.23,28.32 22.54,28 U4.8 | U5.8 16.58,28 16.26,28.32 v16.26,28.7 | R21.2 40.13,33.4 37.59,35.94 ICSP.2 37.59,37.72 | U1.13 39.5,13.33 40.13,12.7 40.13,10.16 C31.2 | R25.2 24.42,18.58 v23.62,17.78 | 18.54,17.78 18.67,17.78 | R24.2 18.54,19.85 18.54,17.91 | 18.54,17.78 18.54,17.91 | 18.41,17.78 18.54,17.91 | 18.54,17.91 18.67,17.78 | C31.2 37.59,7.62 24.89,7.62 23.62,8.89 v23.62,12.7 | v23.62,17.78 23.62,17.53 | v23.62,17.78 18.67,17.78 | R22.1 47.37,33.4 46.48,34.29 46.48,38.1 45.21,39.37 39.24,39.37 37.59,37.72 | 18.54,17.78 18.41,17.78 | 34.16,45.76 R30.1 | R30.1 26.54,45.72 26.16,45.34 U15.2 26.16,38.1 25.4,37.34 C42.+ | 22.61,33.02 22.61,33.27 | 22.61,33.27 22.61,36.83 C42.+ | 22.35,33.02 22.61,33.27 | C31.2 43.09,8.89 R32.1 R33.1 46.01,2.37 46.61,1.78 58.67,1.78 59.31,2.41 67.06,2.41 67.44,2.79 67.44,5.59 66.67,6.35 C51.1 62.48,7.62 61.34,7.62 61.1,7.86 U11.1 | Q4.1 34.1,45.82 R30.1 | C42.+ 23.11,38.61 23.11,39.37 19.81,42.67 3.3V.1
  Bottom 0.203: v28.32,28.7 28.32,29.97 C41.1 | C46.1 22.23,29.84 v22.23,28.7 | v16.26,28.7 16.26,29.84 C48.1 | v23.62,12.7 v23.62,17.78
5V_CODEC  (via drill 0.35)
  Top 0.203: U2.20 69.81,21.27 70.93,21.27 71.25,21.59 C20.2 C19.2 | U14.3 78.26,33.05 v78.23,33.02
  Bottom 0.203: v78.23,33.02 78.23,31.5 79.5,30.23 79.5,24.51 78.23,23.24 74.8,23.24 C20.2
!CS0
  Top 0.203: R25.1 28.32,19.94 29.34,20.96 | 29.34,20.96 29.34,21.08 | 29.34,21.08 U3.1 | U1.7 29.97,20.96 29.46,20.96 | 29.46,20.96 29.34,20.96 | 29.46,20.96 29.34,21.08
!CS1  (via drill 0.35)
  Top 0.203: 20.03,19.94 R24.1 v21.97,19.94 23.37,21.34 U4.1 | U1.14 36.07,12.06 35.69,11.68 35.69,9.78 35.05,9.14 26.42,9.14 25.53,10.03 25.53,14.1 24.26,15.37 22.86,15.37 22.48,15.75 v22.48,16.51
  Bottom 0.203: v21.97,19.94 22.48,19.43 v22.48,16.51
!CS2  (via drill 0.35)
  Top 0.203: R23.1 v16,19.94 17.27,21.21 U5.1 | U1.12 40.77,14.6 41.4,13.97 v41.4,10.16 | v14.73,16.51 14.73,6.35 17.27,3.81 40.13,3.81 41.4,5.08 v41.4,7.62
  Bottom 0.203: v14.73,16.51 14.73,18.67 v16,19.94 | v41.4,7.62 v41.4,10.16
!CS3  (via drill 0.35)
  Top 0.203: U6.1 11.05,24 10.5,24.55 R28.1 v8.38,21.59 | U1.11 43.31,15.87 43.94,15.24 43.94,11.43 v42.67,10.16 | v8.38,17.78 8.38,6.35 12.19,2.54 40.13,2.54 42.67,5.08 v42.67,7.62
  Bottom 0.203: v8.38,21.59 v8.38,17.78 | v42.67,7.62 v42.67,10.16
!MCLR
  Top 0.203: R34.2 35.69,36.19 ICSP.1
+5V
  Top 0.203: U7.2 118.94,9.98 119.13,10.16 119.13,12.95 C40.1 118.87,14.86 121.1,17.09 U10.7 125.91,17.09 C28.1 137.29,16.51 137.92,17.14 137.92,45.72 134.11,49.53 93.85,49.53 | 93.37,49.53 78.74,49.53 74.93,53.34 D2.C R_1.P$10 60.45,52.07 59.73,51.35 44.07,51.31 42.97,52.38 42.76,52.58 R41.1 | 93.37,49.53 93.6,49.53 | 93.6,49.53 93.65,49.53 | U13.3 93.62,49.3 | 93.62,49.3 93.62,49.5 | 93.62,49.5 93.6,49.53 | 93.62,49.5 93.65,49.53 | 93.65,49.53 93.85,49.53 | 93.85,49.53 93.62,49.3 | 93.62,49.28 93.37,49.53
AINA+
  Top 0.152: 70,19.29 71.65,19.29 C10.2
  Top 0.203: U2.17 70,19.29 68.71,19.3 67.69,18.29 67.69,7.24 68.96,5.97 77.85,5.97 81.15,9.27 R5.1 R7.1
AINA-
  Top 0.152: U2.16 70.77,18.64 71.12,18.29 71.12,13.72 72.14,12.7 C10.1
  Top 0.203: R6.1 R8.1 81.66,17.78 80.9,17.02 80.9,13.59 80.01,12.7 C10.1
AMUTE
  Top 0.203: R40.2 105.37,29.04 106.17,29.84 C18.2
AOUTA+
  Top 0.203: U2.25 70.59,24.48 70.99,24.89 70.99,26.92 71.95,27.88 72.39,28.32 72.52,28.45 77.47,28.45 79.5,30.48 R10.2
AOUTA-
  Top 0.203: U2.24 70.83,23.83 71.63,24.64 71.63,26.67 72.39,27.43 77.47,27.43 78.23,26.67 R9.2
CODEC_!RST  (via drill 0.35)
  Top 0.203: U1.15 v56.13,12.06 | U2.14 62.82,17.98 v62.23,17.4
  Bottom 0.203: v62.23,17.4 62.23,14.35 59.94,12.06 v56.13,12.06
DRY
  Top 0.203: C36.1 108.2,3.81 106.43,2.03 91.31,2.03 87.12,6.35 DRY.1
FILT+
  Top 0.203: C22.2 73.15,24.13 71.56,22.54 U2.22
  Bottom 0.203: C22.2 74.42,26.67 C23.+
GND
  Top 0.203: U2.13 63.8,18.67
  pour Top: -1.78,73.66 167.13,73.66 167.13,64.77 167.13,-2.54 159.51,-2.54 -1.78,-2.54
  pour Bottom: -3.05,76.2 170.94,76.2 170.94,-5.08 -4.32,-5.08 -4.32,76.2
I2C_SCL
  Top 0.203: U2.11 65.15,19.93 65.15,19.94 65.53,19.56 65.53,16.64 63.5,14.6 U1.17 46.23,14.6 45.97,14.35 45.97,10.67 47.75,8.89 X.1 | R33.2 50.42,3.56 SCL2.1
  Bottom 0.203: X.1 52.83,6.35 SCL2.1
I2C_SDA
  Top 0.203: U2.12 62.47,19.29 61.47,18.29 56.9,18.29 54.48,15.87 U1.18 45.85,15.87 45.21,15.24 45.21,9.4 47.71,6.9 R32.2 SDA2.1
I2S_COFS
  Top 0.203: U1.26 61.09,26.04 62.64,24.48 U2.4
I2S_CSCLK
  Top 0.203: U2.5 61.26,23.83 60.33,24.76 U1.25
I2S_CSDI
  Top 0.203: U1.24 59.82,23.5 60.14,23.18 U2.6
I2S_CSDO
  Top 0.203: U2.7 61.4,22.54 61.09,22.22 U1.23
ICSP_PGC
  Top 0.203: ICSP.5 45.21,21.84 46.23,20.83 U1.22
ICSP_PGD
  Top 0.203: ICSP.4 42.67,20.45 43.43,19.68 U1.21
N$1
  Top 0.203: U10.3 118.94,16.44 119.25,16.75 119.25,18.03 117.6,19.68 C45.1
N$2  (via drill 0.35)
  Top 0.203: U11.5 60.45,3.94 60.96,3.43 v63.63,3.43
  Bottom 0.203: v63.63,3.43 70.36,3.43 C21.2
N$3
  Top 0.203: U7.1 115.28,10.63 C3.2 114.62,9.33 U7.3
N$4
  Top 0.203: U7.8 123.66,10.63 123.95,10.92 123.95,16 123.52,16.44 U10.6
N$5
  Top 0.203: U7.4 116.12,8.68 115.06,7.62 112.52,7.62 111.89,8.25 111.89,16.89 | 111.69,17.09 108.02,17.09 106.68,15.75 C5.- | 111.69,17.09 111.89,17.09 | 111.89,17.09 112.08,17.09 | 112.08,17.09 U10.2 | 111.89,16.89 111.89,17.09 | 111.89,16.89 111.69,17.09 | 111.89,16.89 112.08,17.09
N$6
  Top 0.203: Q5.1 41.08,49.05 R1.2
N$7
  Top 0.203: C50.2 119.51,32.39 119.51,35.31 118.62,36.19 U8.2 U8.1
  Bottom 0.203: C50.2 117.6,24.13 122.68,19.05 129.03,19.05 130.3,17.78 130.3,6.35 127.76,3.81 C36.2
N$8
  Top 0.203: C30.2 U1.28 47.7,29.39 47.37,29.72 R22.2
N$9
  Top 0.203: C16.- 103.63,27.9 R40.1
N$10
  Top 0.203: U8.3 115.7,34.92 114.64,33.87 R17.1 113.79,43.18 112.52,44.45 85.85,44.45 C26.1
N$11
  Top 0.203: U7.5 120.69,8.68 118.36,6.35 C4.-
N$12
  Top 0.203: 104.01,13.08 C5.+ 104.14,11.94 | U9.5 100.46,11.18 100.84,10.79 103,10.79 104.01,11.81 | R3.2 108.8,14.82 108.33,14.35 108.33,11.56 107.95,11.18 104.9,11.18 104.27,11.81 | 104.27,11.81 104.14,11.94 | 104.01,11.81 104.14,11.94 | 104.01,11.81 104.27,11.81
N$13
  Top 0.203: C4.+ 104.14,7.62 104.14,7.91 | 104.14,7.91 104.14,8 | 104.14,8 102.74,9.4 99.57,9.4 99.19,9.02 U9.3 | R4.2 104.27,8.04 | 104.27,8.04 104.18,8.04 104.14,8 | 104.14,7.91 104.27,8.04
N$14
  Top 0.203: R10.1 R12.2 R13.1 82.04,34.29 C13.1
N$15
  Top 0.203: U9.6 99.19,14.6 C8.1 99.31,18.29 92.08,18.29 91.57,17.78 R8.2
N$16
  Top 0.203: U9.7 97.92,14.6 C8.2 94.61,15.11 R6.2
N$17
  Top 0.203: C7.1 98.3,4.19 97.92,4.57 U9.2 97.92,8.89 97.54,9.27 96.01,9.27 95,8.25 90.04,8.25 86.11,12.19 R7.2
N$18
  Top 0.203: U9.1 96.65,4.7 C7.2 91.82,4.19 86.74,9.27 R5.2
N$19
  Top 0.203: R9.1 R11.2 86.27,24.47 86.11,24.26 C14.2 R14.2
N$20
  Top 0.203: R11.1 89.28,26.67 89.79,27.18 92.46,27.18 92.84,26.8 U12.2 92.84,23.75 93.22,23.37 95,23.37 96.77,21.59 C15.1
N$21
  Top 0.203: 88.1,30.35 R12.1 88.01,30.44 88.01,29.59 89.66,27.94 91.82,27.94 93.47,27.94 94.11,27.3 | 94.11,27.3 94.11,27.18 | 94.11,27.18 U12.3 | C17.1 96.65,27.3 94.23,27.3 | 94.23,27.3 94.11,27.3 | 94.11,27.18 94.23,27.3
N$22
  Top 0.203: D2.A R_1.P$1 57.91,48.26 47.75,48.26 44.11,44.62 Q5.3
N$23
  Top 0.203: U12.1 91.57,23.88 90.51,22.77 R14.1 C15.2 95.38,19.68 103.25,19.68 103.63,20.07 C16.+
N$25  (via drill 0.35)
  Top 0.203: v101.22,33.15 100.58,33.15 99.95,33.78 R16.2
  Bottom 0.203: MIX.1 88.77,3.81 90.81,5.84 101.09,5.84 102.36,7.11 102.36,14.35 102.74,14.73 102.74,18.03 101.85,18.92 101.85,32.51 v101.22,33.15
N$26
  Top 0.203: C18.1 104.9,38.1 98.17,38.1 97.28,37.21 R15.2
N$27
  Top 0.203: R13.2 87.97,38.06 C12.+
N$28
  Bottom 0.203: R_1.P$2 57.91,46.99 59.18,48.26 65.53,48.26 69.6,52.32 75.18,52.32 77.47,54.61 82.04,54.61 83.31,53.34 C26.2
N$29
  Top 0.203: U8.6 124.33,34.92 124.55,34.71 R20.1 R18.1
N$30
  Top 0.203: U8.5 121.41,33.66 120.99,33.23 120.99,29.68 119.89,28.57 115.57,28.57 115.36,28.79 R19.2
N$31
  Top 0.203: Q6.1 125.16,30.79 124.84,30.48 C50.1 R2.1
N$32
  Top 0.203: U8.7 124.46,36.19 124.67,36.41 R20.2 125.73,38.86 127.51,40.64 135.38,40.64 136.65,39.37 136.65,25.78 135,24.13 131.57,24.13 127.76,20.32 124.33,20.32 C45.2
N$33
  Top 0.203: U1.20 50.93,18.41 C29.+
N$34
  Top 0.203: U1.9 36.32,18.41 35.31,19.43 32.89,19.43 32.51,19.05 Q1.1 31.41,15.91 C33.2
N$35
  Top 0.203: U1.10 36.32,17.14 32.51,13.33 Q1.2 31.54,13.17 C32.2
N$36
  Top 0.203: OUTPUT.P$3 149.35,53.34 146.07,56.62 57.38,56.62 55.37,54.61 R_1.P$8
N$37
  Top 0.203: R18.2 131.15,36.41 C44.1
N$38
  Top 0.203: C38.2 78.23,52.07 74.68,55.63 59.18,55.63 57.91,54.36 R_1.P$9
N$39
  Bottom 0.203: R_1.P$3 52.83,43.18 49.02,43.18 45.21,46.99 45.21,53.34 42.67,55.88 21.72,55.88 INPUT.P$3
N$40  (via drill 0.35)
  Top 0.203: R26.1 118.87,24.51 119.63,23.75 125.35,23.75 v126.66,25.06 Q6.2
  Bottom 0.203: C44.2 132.84,31.75 130.3,29.21 130.3,27.18 129.79,26.67 128.27,26.67 v126.66,25.06
N$41
  Top 0.203: D1.C 133.35,20.83 132.5,19.98 R29.1
  Bottom 0.203: C49.+ 133.35,25.91 D1.C
N$42  (via drill 0.35)
  Top 0.203: v65.79,4.7 61.72,4.7 61.1,5.32 U11.6
  Bottom 0.203: v65.79,4.7 66.42,5.33 79.25,5.33 80.26,6.35 PIN.1
N$43
  Top 0.203: R34.1 35.69,29.08 36.2,28.57 U1.1 39.75,28.57 40.13,28.96 R21.1
N$44
  Top 0.203: U12.6 94.11,32 95.12,33.02 96.52,33.02 97.28,33.78 R15.1 | R38.2 95.67,36.41 96.01,36.07 96.01,34.92 96.27,34.67 97.24,34.67 R15.1 | R15.1 98.21,34.71 98.68,35.18 98.68,36.07 99.02,36.41 R16.1
N$45
  Top 0.203: U2.2 65.92,25.79 69.22,29.08 Q2.2 68.49,31.2 C34.1
N$46
  Top 0.203: D1.A 129.03,25.4 129.03,29.68 Q6.3
N$47
  Top 0.203: C38.1 82.93,43.56 92.33,43.56 93.34,42.55 93.34,35.05 93.69,34.71 R38.1 94.74,33.91 92.84,32 U12.7
N$48
  Top 0.203: U2.1 62.47,26.43 61.59,27.3 61.59,29.59 62.48,30.48 Q2.1 64.98,31.03 C35.1
N$49
  Top 0.203: R39.2 102.62,32.51 102.11,32 95.76,32 95.38,31.62 U12.5
N$50
  Top 0.203: C21.1 75.82,3.81 POUT.1
N$51  (via drill 0.35)
  Top 0.203: R29.2 135.89,18.54 v136.65,17.78
  Bottom 0.203: v136.65,17.78 136.65,3.05 134.59,0.99 60.22,1.12 TAILS.1
N$54
  Top 0.203: R1.1 R41.2 | 39.28,52.92 R41.2 | Q4.3 36.79,51.9 37.47,52.58 R41.2
RELAY_CTRL
  Top 0.203: CTRL.1 52.83,40.64 51.56,41.91 40.13,41.91 37.59,44.45 37.59,45.08 36.96,45.72 R30.2 36,45.82 Q4.2
SCL1
  Top 0.203: SCL1.1 52.83,10.29 53.34,10.79 59.18,10.79 59.82,10.16 59.8,10.14 U11.3
SDA1
  Top 0.203: SDA1.1 56.64,8.89 57.91,7.62 59.44,7.62 59.8,7.25 U11.4
SPI_SCL
  Top 0.203: U1.5 35.43,23.5 32.64,26.29 32,26.29 | 31.88,26.42 U3.6 | 31.88,26.29 31.88,26.42 | 25.91,26.29 26.04,26.29 | 26.04,26.29 31.75,26.29 | 31.75,26.29 31.88,26.29 | 31.88,26.42 31.75,26.29 | U5.6 19.81,26.42 | 19.81,26.42 19.81,26.29 | 19.81,26.29 19.94,26.29 | 19.94,26.29 25.78,26.29 | 25.78,26.29 25.91,26.29 | U6.6 13.59,26.54 13.84,26.29 19.68,26.29 | 19.68,26.29 19.81,26.29 | 19.81,26.42 19.68,26.29 | 19.81,26.42 19.94,26.29 | 25.91,26.29 25.91,26.42 | 25.91,26.42 U4.6 | 25.91,26.42 25.78,26.29 | 25.91,26.42 26.04,26.29 | 32,26.29 31.88,26.29 | 31.88,26.42 32,26.29
SPI_SDI
  Top 0.203: U3.2 30.61,24.76 | 30.61,24.76 30.48,24.89 | 30.48,24.89 24.77,24.89 | 24.77,24.89 24.64,24.89 | 24.64,24.89 24.51,24.89 | 24.51,24.89 18.67,24.89 | 18.67,24.89 18.54,24.89 | 18.54,24.89 18.41,24.89 | 18.41,24.89 13.08,24.89 12.32,24.13 U6.2 | U4.2 24.64,24.76 | 24.64,24.76 24.64,24.89 | 18.54,24.89 18.54,24.76 | 18.54,24.76 U5.2 | 18.54,24.76 18.41,24.89 | 18.54,24.76 18.67,24.89 | 24.64,24.76 24.51,24.89 | 24.64,24.76 24.77,24.89 | U1.6 35.81,22.22 33.15,24.89 30.73,24.89 | 30.73,24.89 30.48,24.89 | 30.61,24.76 30.73,24.89
SPI_SDO
  Top 0.203: U1.4 35.05,24.76 33.15,26.67 U3.5 33.15,29.46 33.02,29.59 27.3,29.59 | 27.3,29.59 27.18,29.59 | 27.18,29.59 27.05,29.59 | 27.05,29.59 21.21,29.59 | 21.21,29.59 21.08,29.59 | 21.08,29.59 20.96,29.59 | 20.96,29.59 15.24,29.59 14.86,29.21 U6.5 | U5.5 21.08,29.46 | 21.08,29.46 21.08,29.59 | 21.08,29.46 21.21,29.59 | 21.08,29.46 20.96,29.59 | U4.5 27.18,29.46 | 27.18,29.46 27.18,29.59 | 27.18,29.46 27.3,29.59 | 27.18,29.46 27.05,29.59
THRU
  Bottom 0.203: R_1.P$7 R_1.P$4
V+  (via drill 0.35)
  Top 0.203: U8.8 121.67,37.47 121.41,37.72 C2.1 | U12.8 C39.1 | C27.1 96.39,11.05 96.65,11.3 U9.8
  Top 0.508: U16.3 60.22,37.87 61.72,39.37 C43.+ 73.15,39.37 v73.64,38.89 U14.1 | R36.2 v109.98,39.37 | v86.49,46.36 86.56,46.43 U13.1 | U15.3 v37.26,42.62
  Bottom 0.508: C27.1 92.2,12.7 92.2,16.51 89.66,19.05 89.66,22.86 90.3,23.5 90.3,33.02 C39.1 89.66,36.19 81.15,36.19 78.99,38.35 | v73.64,38.89 73.66,38.86 78.49,38.86 | 78.99,38.35 78.49,38.86 | C2.1 119.51,41.91 110.36,41.91 | 78.99,39.37 81.53,41.91 84.07,41.91 | 78.99,39.37 78.49,38.86 | 110.36,41.91 109.98,41.91 | 109.98,41.91 109.47,41.91 | 109.47,41.91 84.84,41.91 | 84.84,41.91 84.45,41.91 | 84.45,41.91 84.07,41.91 | 78.99,38.35 78.99,39.37 | v109.98,39.37 109.98,41.53 | 109.98,41.53 109.98,41.91 | 109.47,41.91 109.98,41.53 | 109.98,41.53 110.36,41.91 | +9V.1 50.29,38.86 | 50.29,38.86 50.29,39.37 | 50.29,39.37 49.02,40.64 39.24,40.64 v37.26,42.62 | C43.+ 66.29,39.37 64.64,41.02 61.34,41.02 59.69,39.37 50.8,39.37 | 50.8,39.37 50.29,39.37 | 50.29,38.86 50.8,39.37 | v86.49,46.36 86.36,46.36 84.45,44.45 84.45,42.29 | 84.45,42.29 84.45,41.91 | 84.45,42.29 84.07,41.91 | 84.45,42.29 84.84,41.91
VCOM
  Top 0.152: U2.15 68.91,17.98 68.71,17.78 68.71,16.51 69.6,15.62 | 69.6,15.62 C11.2 | C6.+ 68.33,9.91 68.33,14.35 69.6,15.62
  Top 0.203: R3.1 R4.1 109.89,9.65 104.01,9.65 103.63,10.03 95.5,10.03 94.87,9.4 90.3,9.4 86.11,13.59 82.8,13.59 81.15,11.94 77.85,11.94 C9.2 76.33,8.13 75.06,6.86 71.37,6.86 C6.+
VREF
  Top 0.203: R39.1 104.05,36.41 108.29,32.17 R36.1 | R36.1 R17.2 | R37.1 108.75,28.79 107.44,27.43 107.44,25.4 108.71,24.13 C37.+ | R36.1 R37.1 | R37.1 110.02,28.83 | R37.1 111.42,28.79 112.01,28.19 112.01,27.56 112.48,27.09 R19.1 118.82,27.09 R26.2 120.31,27.14 120.9,26.54 120.9,25.91 121.37,25.44 R2.2

### Text on the board
tPlace: Date / Serial: | (c) T.Grubb 2018 | PITCH DELAY | DSP BOARD v2.2